# Altium project LPCB224__RLOOP__CORE_NODE.PrjPCB
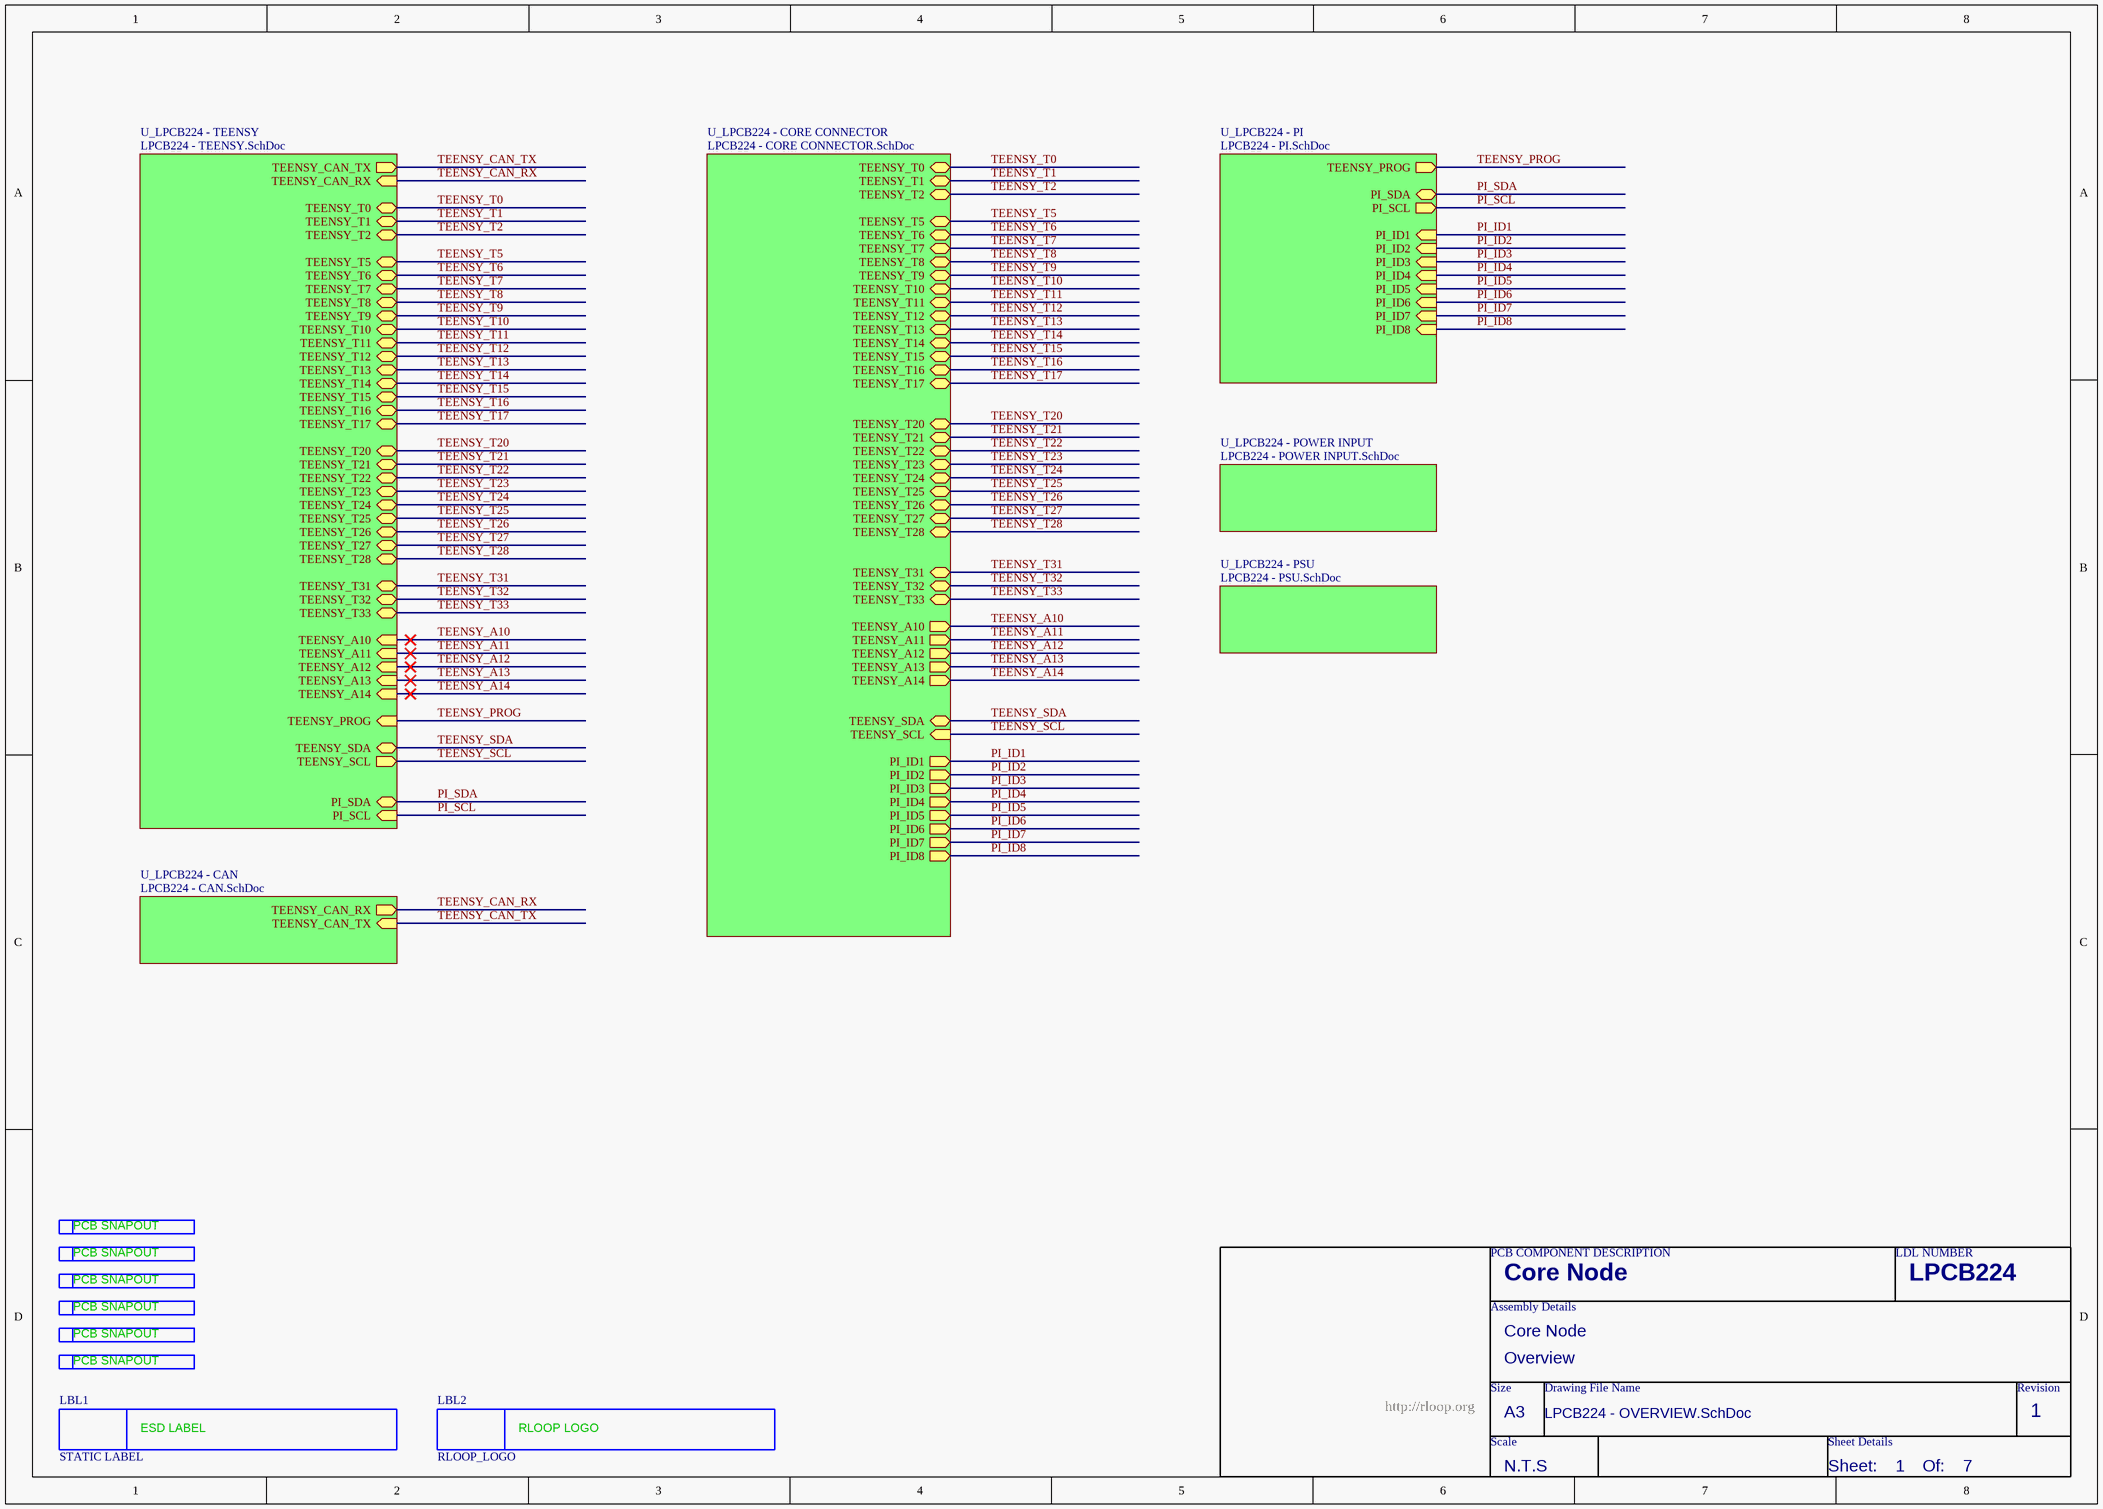
[diagram p0: LPCB224 - OVERVIEW.SchDoc]
7 sheets, 83 parts. Net scope: hierarchical (ports join the sheet entries above them; power ports are global).
Board files: LPCB224R0.PcbDoc, LPCB224R0__ASCII.PcbDoc
Sheets:
  LPCB224 - OVERVIEW.SchDoc
    U_LPCB224 - TEENSY = LPCB224 - TEENSY.SchDoc
    U_LPCB224 - CAN = LPCB224 - CAN.SchDoc
    U_LPCB224 - PSU = LPCB224 - PSU.SchDoc
    U_LPCB224 - PI = LPCB224 - PI.SchDoc
    U_LPCB224 - CORE CONNECTOR = LPCB224 - CORE CONNECTOR.SchDoc
    U_LPCB224 - POWER INPUT = LPCB224 - POWER INPUT.SchDoc

## Sheet LPCB224 - OVERVIEW.SchDoc
size A3; Address1: Factory 10; Address2: 9-13 Dingley Avenue, Dandeong, VICTORIA 3175, AUSTRALIA; DocumentNumber: 1; Revision: 1; SheetNumber: 1; SheetTotal: 7; Lockie__PCB_SUB_ASSEMBLY: Overview; Lockie__PCB_ASSEMBLY: Core Node; Lockie__LDL: LPCB224; Lockie__PCB_DESCRIPTION: Core Node

### Parts
LBL1  STATIC LABEL  [STATIC_LABEL]  (no BOM)
LBL2  RLOOP_LOGO  [RLOOP_LOGO]  (no BOM)
SN1  PCB_SNAPOUT  [SNAPOUT_NEW]  (value not drawn)  (no BOM)
SN2  PCB_SNAPOUT  [SNAPOUT_NEW]  (value not drawn)  (no BOM)
SN3  PCB_SNAPOUT  [SNAPOUT_NEW]  (value not drawn)  (no BOM)
SN4  PCB_SNAPOUT  [SNAPOUT_NEW]  (value not drawn)  (no BOM)
SN5  PCB_SNAPOUT  [SNAPOUT_NEW]  (value not drawn)  (no BOM)
SN6  PCB_SNAPOUT  [SNAPOUT_NEW]  (value not drawn)  (no BOM)

### Sub-sheets
U_LPCB224 - CAN = LPCB224 - CAN.SchDoc: TEENSY_CAN_TX (in), TEENSY_CAN_RX (out)
U_LPCB224 - CORE CONNECTOR = LPCB224 - CORE CONNECTOR.SchDoc: TEENSY_T0 (bidir), TEENSY_T1 (bidir), TEENSY_T2 (bidir), TEENSY_T5 (bidir), TEENSY_T6 (bidir), TEENSY_T7 (bidir), TEENSY_T8 (bidir), TEENSY_T9 (bidir), TEENSY_T10 (bidir), TEENSY_T11 (bidir), TEENSY_T12 (bidir), TEENSY_T13 (bidir), TEENSY_T14 (bidir), TEENSY_T15 (bidir), TEENSY_T16 (bidir), TEENSY_T17 (bidir), TEENSY_T20 (bidir), TEENSY_T21 (bidir), TEENSY_T22 (bidir), TEENSY_T23 (bidir), TEENSY_T24 (bidir), TEENSY_T25 (bidir), TEENSY_T26 (bidir), TEENSY_T27 (bidir), TEENSY_T28 (bidir), TEENSY_T31 (bidir), TEENSY_T32 (bidir), TEENSY_T33 (bidir), TEENSY_A10 (out), TEENSY_A11 (out), TEENSY_A12 (out), TEENSY_A13 (out), TEENSY_A14 (out), TEENSY_SCL (in), TEENSY_SDA (bidir), PI_ID1 (out), PI_ID2 (out), PI_ID3 (out), PI_ID4 (out), PI_ID5 (out), PI_ID6 (out), PI_ID7 (out), PI_ID8 (out)
U_LPCB224 - PI = LPCB224 - PI.SchDoc: PI_ID1 (in), PI_ID2 (in), PI_ID3 (in), PI_ID4 (in), PI_ID5 (in), PI_ID6 (in), PI_ID7 (in), PI_ID8 (in), PI_SDA (bidir), PI_SCL (out), TEENSY_PROG (out)
U_LPCB224 - POWER INPUT = LPCB224 - POWER INPUT.SchDoc: no entries
U_LPCB224 - PSU = LPCB224 - PSU.SchDoc: no entries
U_LPCB224 - TEENSY = LPCB224 - TEENSY.SchDoc: TEENSY_T0 (bidir), TEENSY_T1 (bidir), TEENSY_T2 (bidir), TEENSY_CAN_TX (out), TEENSY_CAN_RX (in), TEENSY_T5 (bidir), TEENSY_T6 (bidir), TEENSY_T7 (bidir), TEENSY_T8 (bidir), TEENSY_T9 (bidir), TEENSY_T10 (bidir), TEENSY_T11 (bidir), TEENSY_T12 (bidir), TEENSY_T13 (bidir), TEENSY_T14 (bidir), TEENSY_T15 (bidir), TEENSY_T16 (bidir), TEENSY_T17 (bidir), TEENSY_T20 (bidir), TEENSY_T21 (bidir), TEENSY_T22 (bidir), TEENSY_T23 (bidir), TEENSY_T24 (bidir), TEENSY_T25 (bidir), TEENSY_T26 (bidir), TEENSY_T27 (bidir), TEENSY_T28 (bidir), TEENSY_T31 (bidir), TEENSY_T32 (bidir), TEENSY_T33 (bidir), TEENSY_A10 (in), TEENSY_A11 (in), TEENSY_A12 (in), TEENSY_A13 (in), TEENSY_A14 (in), TEENSY_PROG (in), TEENSY_SCL (out), TEENSY_SDA (bidir), PI_SCL (in), PI_SDA (bidir)

### Nets
PI_ID1: sheet U_LPCB224 - PI/PI_ID1, sheet U_LPCB224 - CORE CONNECTOR/PI_ID1
PI_ID2: sheet U_LPCB224 - PI/PI_ID2, sheet U_LPCB224 - CORE CONNECTOR/PI_ID2
PI_ID3: sheet U_LPCB224 - PI/PI_ID3, sheet U_LPCB224 - CORE CONNECTOR/PI_ID3
PI_ID4: sheet U_LPCB224 - PI/PI_ID4, sheet U_LPCB224 - CORE CONNECTOR/PI_ID4
PI_ID5: sheet U_LPCB224 - PI/PI_ID5, sheet U_LPCB224 - CORE CONNECTOR/PI_ID5
PI_ID6: sheet U_LPCB224 - PI/PI_ID6, sheet U_LPCB224 - CORE CONNECTOR/PI_ID6
PI_ID7: sheet U_LPCB224 - PI/PI_ID7, sheet U_LPCB224 - CORE CONNECTOR/PI_ID7
PI_ID8: sheet U_LPCB224 - PI/PI_ID8, sheet U_LPCB224 - CORE CONNECTOR/PI_ID8
PI_SCL: sheet U_LPCB224 - TEENSY/PI_SCL, sheet U_LPCB224 - PI/PI_SCL
PI_SDA: sheet U_LPCB224 - TEENSY/PI_SDA, sheet U_LPCB224 - PI/PI_SDA
TEENSY_A10: sheet U_LPCB224 - TEENSY/TEENSY_A10, sheet U_LPCB224 - CORE CONNECTOR/TEENSY_A10
TEENSY_A11: sheet U_LPCB224 - TEENSY/TEENSY_A11, sheet U_LPCB224 - CORE CONNECTOR/TEENSY_A11
TEENSY_A12: sheet U_LPCB224 - TEENSY/TEENSY_A12, sheet U_LPCB224 - CORE CONNECTOR/TEENSY_A12
TEENSY_A13: sheet U_LPCB224 - TEENSY/TEENSY_A13, sheet U_LPCB224 - CORE CONNECTOR/TEENSY_A13
TEENSY_A14: sheet U_LPCB224 - TEENSY/TEENSY_A14, sheet U_LPCB224 - CORE CONNECTOR/TEENSY_A14
TEENSY_CAN_RX: sheet U_LPCB224 - TEENSY/TEENSY_CAN_RX, sheet U_LPCB224 - CAN/TEENSY_CAN_RX
TEENSY_CAN_TX: sheet U_LPCB224 - TEENSY/TEENSY_CAN_TX, sheet U_LPCB224 - CAN/TEENSY_CAN_TX
TEENSY_PROG: sheet U_LPCB224 - TEENSY/TEENSY_PROG, sheet U_LPCB224 - PI/TEENSY_PROG
TEENSY_SCL: sheet U_LPCB224 - TEENSY/TEENSY_SCL, sheet U_LPCB224 - CORE CONNECTOR/TEENSY_SCL
TEENSY_SDA: sheet U_LPCB224 - TEENSY/TEENSY_SDA, sheet U_LPCB224 - CORE CONNECTOR/TEENSY_SDA
TEENSY_T0: sheet U_LPCB224 - TEENSY/TEENSY_T0, sheet U_LPCB224 - CORE CONNECTOR/TEENSY_T0
TEENSY_T1: sheet U_LPCB224 - TEENSY/TEENSY_T1, sheet U_LPCB224 - CORE CONNECTOR/TEENSY_T1
TEENSY_T2: sheet U_LPCB224 - TEENSY/TEENSY_T2, sheet U_LPCB224 - CORE CONNECTOR/TEENSY_T2
TEENSY_T5: sheet U_LPCB224 - TEENSY/TEENSY_T5, sheet U_LPCB224 - CORE CONNECTOR/TEENSY_T5
TEENSY_T6: sheet U_LPCB224 - TEENSY/TEENSY_T6, sheet U_LPCB224 - CORE CONNECTOR/TEENSY_T6
TEENSY_T7: sheet U_LPCB224 - TEENSY/TEENSY_T7, sheet U_LPCB224 - CORE CONNECTOR/TEENSY_T7
TEENSY_T8: sheet U_LPCB224 - TEENSY/TEENSY_T8, sheet U_LPCB224 - CORE CONNECTOR/TEENSY_T8
TEENSY_T9: sheet U_LPCB224 - TEENSY/TEENSY_T9, sheet U_LPCB224 - CORE CONNECTOR/TEENSY_T9
TEENSY_T10: sheet U_LPCB224 - TEENSY/TEENSY_T10, sheet U_LPCB224 - CORE CONNECTOR/TEENSY_T10
TEENSY_T11: sheet U_LPCB224 - TEENSY/TEENSY_T11, sheet U_LPCB224 - CORE CONNECTOR/TEENSY_T11
TEENSY_T12: sheet U_LPCB224 - TEENSY/TEENSY_T12, sheet U_LPCB224 - CORE CONNECTOR/TEENSY_T12
TEENSY_T13: sheet U_LPCB224 - TEENSY/TEENSY_T13, sheet U_LPCB224 - CORE CONNECTOR/TEENSY_T13
TEENSY_T14: sheet U_LPCB224 - TEENSY/TEENSY_T14, sheet U_LPCB224 - CORE CONNECTOR/TEENSY_T14
TEENSY_T15: sheet U_LPCB224 - TEENSY/TEENSY_T15, sheet U_LPCB224 - CORE CONNECTOR/TEENSY_T15
TEENSY_T16: sheet U_LPCB224 - TEENSY/TEENSY_T16, sheet U_LPCB224 - CORE CONNECTOR/TEENSY_T16
TEENSY_T17: sheet U_LPCB224 - TEENSY/TEENSY_T17, sheet U_LPCB224 - CORE CONNECTOR/TEENSY_T17
TEENSY_T20: sheet U_LPCB224 - TEENSY/TEENSY_T20, sheet U_LPCB224 - CORE CONNECTOR/TEENSY_T20
TEENSY_T21: sheet U_LPCB224 - TEENSY/TEENSY_T21, sheet U_LPCB224 - CORE CONNECTOR/TEENSY_T21
TEENSY_T22: sheet U_LPCB224 - TEENSY/TEENSY_T22, sheet U_LPCB224 - CORE CONNECTOR/TEENSY_T22
TEENSY_T23: sheet U_LPCB224 - TEENSY/TEENSY_T23, sheet U_LPCB224 - CORE CONNECTOR/TEENSY_T23
TEENSY_T24: sheet U_LPCB224 - TEENSY/TEENSY_T24, sheet U_LPCB224 - CORE CONNECTOR/TEENSY_T24
TEENSY_T25: sheet U_LPCB224 - TEENSY/TEENSY_T25, sheet U_LPCB224 - CORE CONNECTOR/TEENSY_T25
TEENSY_T26: sheet U_LPCB224 - TEENSY/TEENSY_T26, sheet U_LPCB224 - CORE CONNECTOR/TEENSY_T26
TEENSY_T27: sheet U_LPCB224 - TEENSY/TEENSY_T27, sheet U_LPCB224 - CORE CONNECTOR/TEENSY_T27
TEENSY_T28: sheet U_LPCB224 - TEENSY/TEENSY_T28, sheet U_LPCB224 - CORE CONNECTOR/TEENSY_T28
TEENSY_T31: sheet U_LPCB224 - TEENSY/TEENSY_T31, sheet U_LPCB224 - CORE CONNECTOR/TEENSY_T31
TEENSY_T32: sheet U_LPCB224 - TEENSY/TEENSY_T32, sheet U_LPCB224 - CORE CONNECTOR/TEENSY_T32
TEENSY_T33: sheet U_LPCB224 - TEENSY/TEENSY_T33, sheet U_LPCB224 - CORE CONNECTOR/TEENSY_T33

### Notes on the sheet
- PCB COMPONENT DESCRIPTION
- LDL NUMBER
- Assembly Details
- Size
- Drawing File Name
- Revision
- http://rloop.org
- Scale
- A3
- Sheet Details
- N.T.S
- Sheet:
- Of:
- (in symbol PCB_SNAPOUT) PCB SNAPOUT
- (in symbol RLOOP_LOGO) RLOOP LOGO
- (in symbol STATIC LABEL) ESD LABEL

### Library data of the parts
LBL1 = STATIC LABEL: FMEDA__CHANNEL: DIAG; FMEDA__FUNCTION_IN_SYSTEM: *
LBL2 = RLOOP_LOGO: FMEDA__CHANNEL: DIAG; FMEDA__FUNCTION_IN_SYSTEM: *
SN1-SN6 = PCB_SNAPOUT: FMEDA__CHANNEL: DIAG; FMEDA__FUNCTION_IN_SYSTEM: *

## Sheet LPCB224 - TEENSY.SchDoc
size A3; Address1: Factory 10; Address2: 9-13 Dingley Avenue, Dandeong, VICTORIA 3175, AUSTRALIA; DocumentNumber: 7; Revision: 1; SheetNumber: 7; SheetTotal: 7; Lockie__PCB_SUB_ASSEMBLY: Teensy Interface; Lockie__PCB_ASSEMBLY: Core Node; Lockie__LDL: LPCB224; Lockie__PCB_DESCRIPTION: Core Node
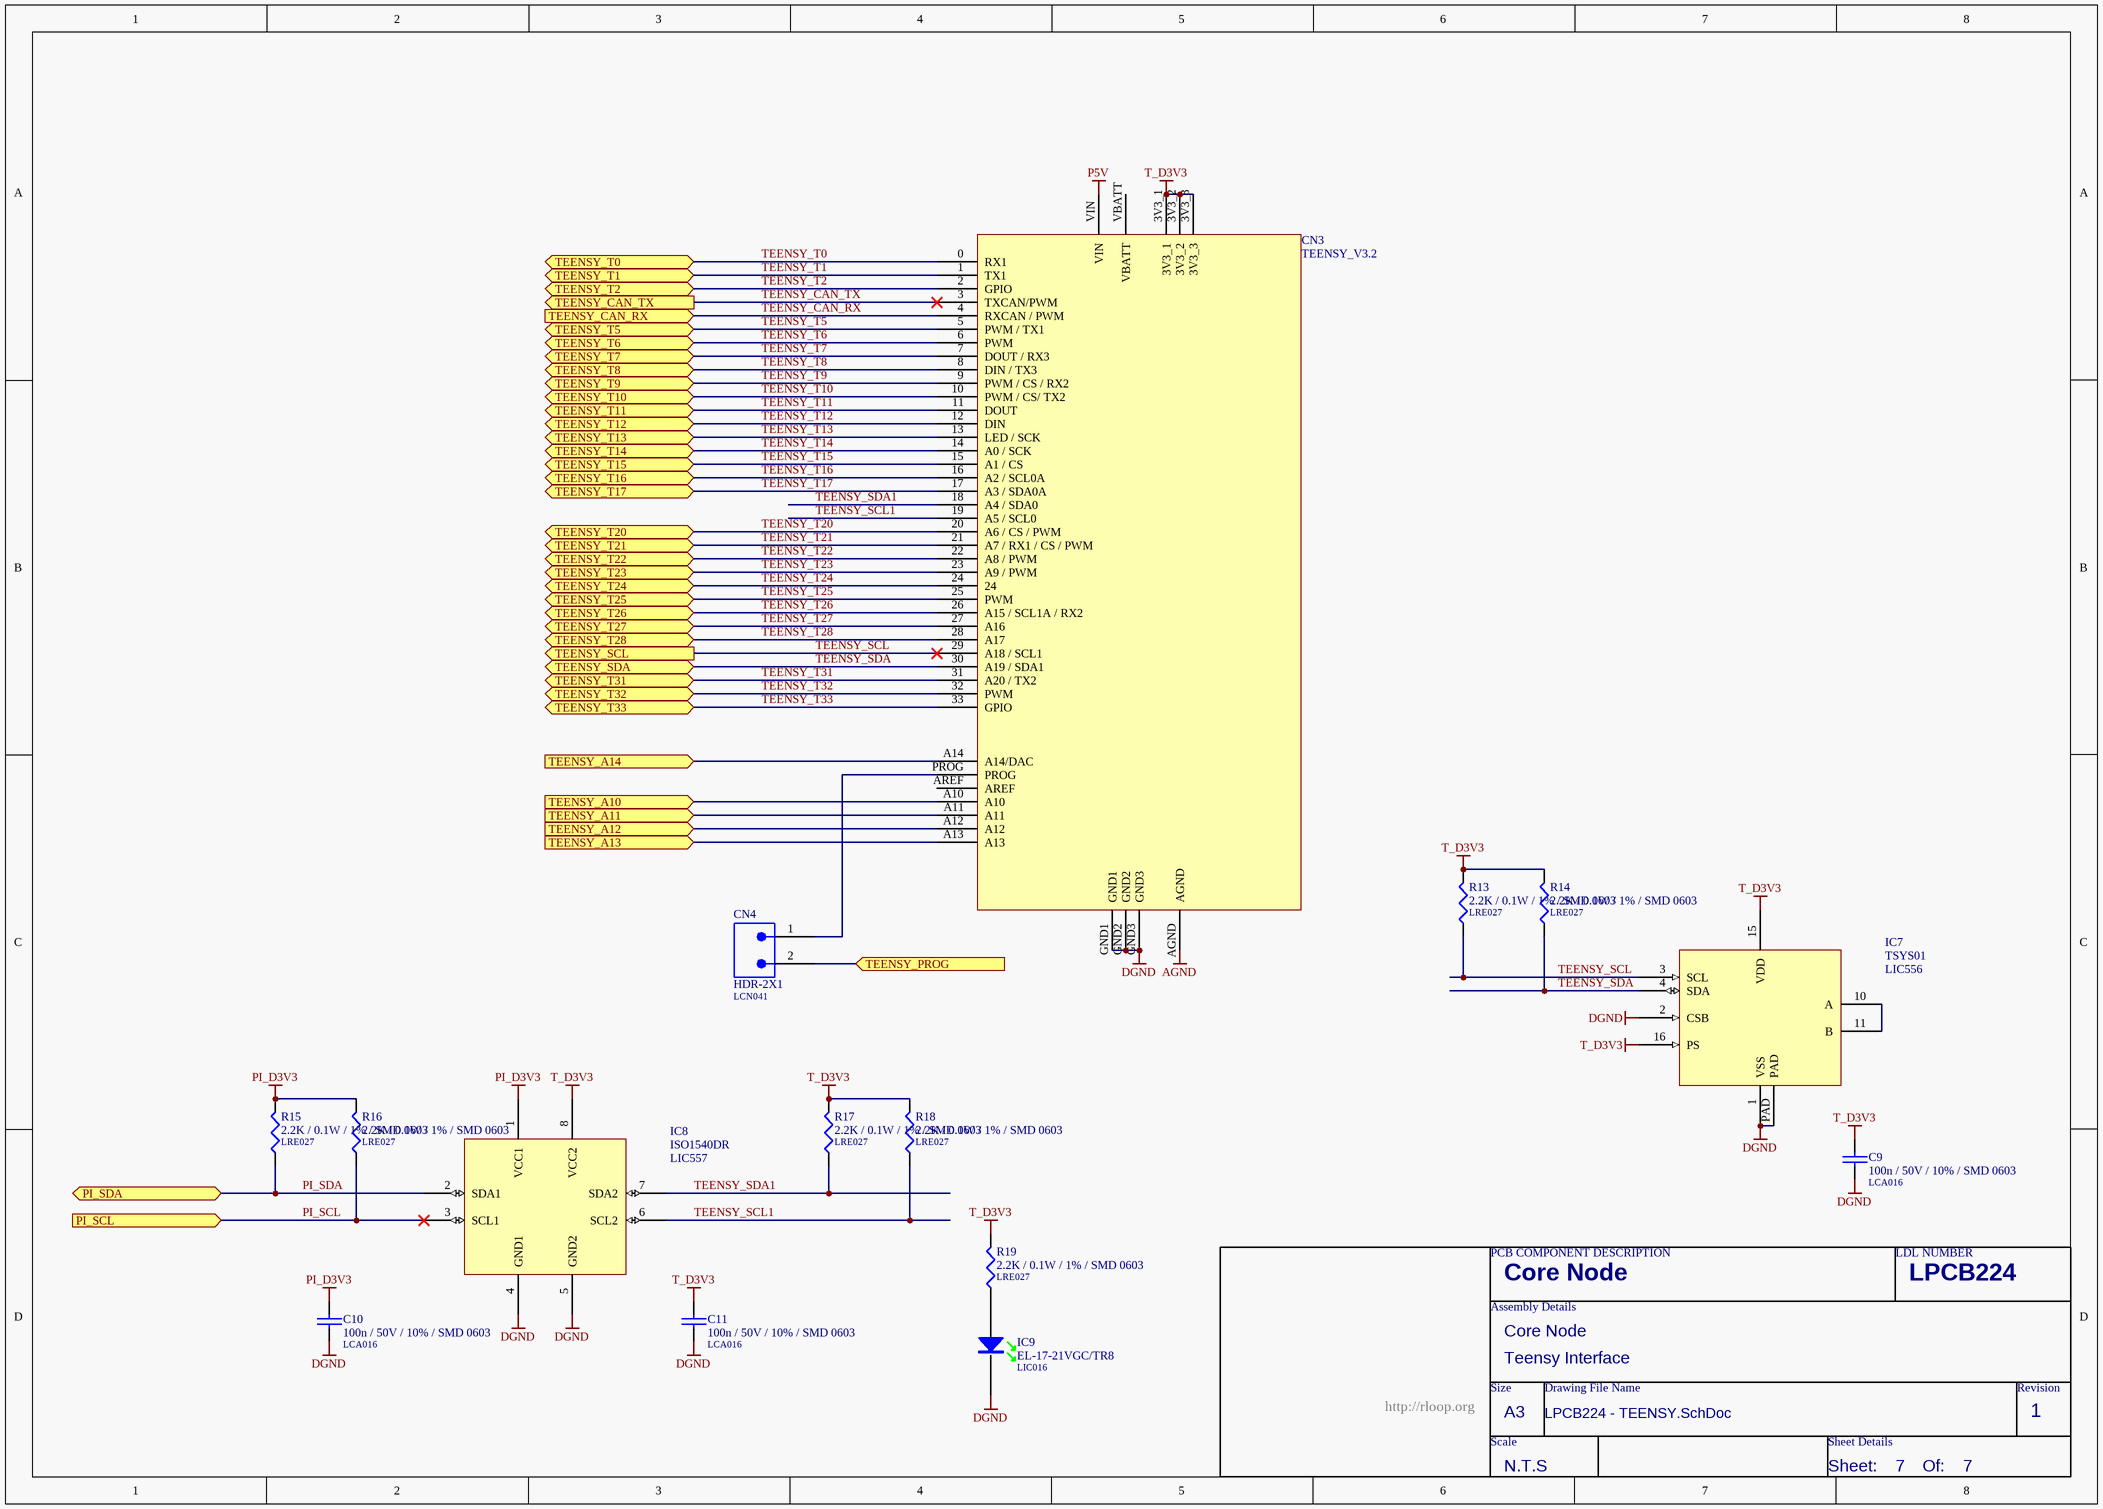
[diagram p1: LPCB224 - TEENSY.SchDoc]

### Parts
C9  100n / 50V / 10% / SMD 0603  LDL_NUMBER: LCA016  [LFP011__CC1608-0603-IPC7351_B]
C10  100n / 50V / 10% / SMD 0603  LDL_NUMBER: LCA016  [LFP011__CC1608-0603-IPC7351_B]
C11  100n / 50V / 10% / SMD 0603  LDL_NUMBER: LCA016  [LFP011__CC1608-0603-IPC7351_B]
CN3  TEENSY_V3.2  [TEENSY_V3.2]  (no BOM)
CN4  HDR-2X1  LDL_NUMBER: LCN041  [HDR-2X1]
IC7  TSYS01  LDL_NUMBER: LIC556  [LFP135__QFN65P400X400X80_HS-17M]
IC8  ISO1540DR  LDL_NUMBER: LIC557  [LFP097__SOIC150-8]
IC9  EL-17-21VGC/TR8  LDL_NUMBER: LIC016  [CR2012-0805-LED]
R13  2.2K / 0.1W / 1% / SMD 0603  LDL_NUMBER: LRE027  [LFP020__CR1608-0603-IPC7351_B]
R14  2.2K / 0.1W / 1% / SMD 0603  LDL_NUMBER: LRE027  [LFP020__CR1608-0603-IPC7351_B]
R15  2.2K / 0.1W / 1% / SMD 0603  LDL_NUMBER: LRE027  [LFP020__CR1608-0603-IPC7351_B]
R16  2.2K / 0.1W / 1% / SMD 0603  LDL_NUMBER: LRE027  [LFP020__CR1608-0603-IPC7351_B]
R17  2.2K / 0.1W / 1% / SMD 0603  LDL_NUMBER: LRE027  [LFP020__CR1608-0603-IPC7351_B]
R18  2.2K / 0.1W / 1% / SMD 0603  LDL_NUMBER: LRE027  [LFP020__CR1608-0603-IPC7351_B]
R19  2.2K / 0.1W / 1% / SMD 0603  LDL_NUMBER: LRE027  [LFP020__CR1608-0603-IPC7351_B]

### Ports
PI_SCL (in), PI_SDA (bidir), TEENSY_A10 (in), TEENSY_A11 (in), TEENSY_A12 (in), TEENSY_A13 (in), TEENSY_A14 (in), TEENSY_CAN_RX (in), TEENSY_CAN_TX (out), TEENSY_PROG (in), TEENSY_SCL (out), TEENSY_SDA (bidir), TEENSY_T0 (bidir), TEENSY_T1 (bidir), TEENSY_T2 (bidir), TEENSY_T5 (bidir), TEENSY_T6 (bidir), TEENSY_T7 (bidir), TEENSY_T8 (bidir), TEENSY_T9 (bidir), TEENSY_T10 (bidir), TEENSY_T11 (bidir), TEENSY_T12 (bidir), TEENSY_T13 (bidir), TEENSY_T14 (bidir), TEENSY_T15 (bidir), TEENSY_T16 (bidir), TEENSY_T17 (bidir), TEENSY_T20 (bidir), TEENSY_T21 (bidir), TEENSY_T22 (bidir), TEENSY_T23 (bidir), TEENSY_T24 (bidir), TEENSY_T25 (bidir), TEENSY_T26 (bidir), TEENSY_T27 (bidir), TEENSY_T28 (bidir), TEENSY_T31 (bidir), TEENSY_T32 (bidir), TEENSY_T33 (bidir)

### Nets
AGND: CN3.AGND
DGND: C9.2 C10.2 C11.2 CN3.GND1 CN3.GND2 CN3.GND3 IC7.1(VSS) IC7.2(CSB) IC7.PAD IC8.4(GND1) IC8.5(GND2) IC9.K
P5V: CN3.VIN
PI_D3V3: C10.1 IC8.1(VCC1) R15.2 R16.2
T_D3V3: C9.1 C11.1 CN3.3V3_1 CN3.3V3_2 CN3.3V3_3 IC7.15(VDD) IC7.16(PS) IC8.8(VCC2) R13.2 R14.2 R17.2 R18.2 R19.2
PI_SCL: IC8.3(SCL1) R16.1 ; port PI_SCL
PI_SDA: IC8.2(SDA1) R15.1 ; port PI_SDA
TEENSY_A10: CN3.A10 ; port TEENSY_A10
TEENSY_A11: CN3.A11 ; port TEENSY_A11
TEENSY_A12: CN3.A12 ; port TEENSY_A12
TEENSY_A13: CN3.A13 ; port TEENSY_A13
TEENSY_A14: CN3.A14(A14/DAC) ; port TEENSY_A14
TEENSY_CAN_RX: CN3.4(RXCAN_/_PWM) ; port TEENSY_CAN_RX
TEENSY_CAN_TX: CN3.3(TXCAN/PWM) ; port TEENSY_CAN_TX
TEENSY_PROG: CN4.2 ; port TEENSY_PROG
TEENSY_SCL: CN3.29(A18_/_SCL1) IC7.3(SCL) R13.1 ; port TEENSY_SCL
TEENSY_SCL1: CN3.19(A5_/_SCL0) IC8.6(SCL2) R18.1
TEENSY_SDA: CN3.30(A19_/_SDA1) IC7.4(SDA) R14.1 ; port TEENSY_SDA
TEENSY_SDA1: CN3.18(A4_/_SDA0) IC8.7(SDA2) R17.1
TEENSY_T0: CN3.0(RX1) ; port TEENSY_T0
TEENSY_T1: CN3.1(TX1) ; port TEENSY_T1
TEENSY_T2: CN3.2(GPIO) ; port TEENSY_T2
TEENSY_T5: CN3.5(PWM_/_TX1) ; port TEENSY_T5
TEENSY_T6: CN3.6(PWM) ; port TEENSY_T6
TEENSY_T7: CN3.7(DOUT_/_RX3) ; port TEENSY_T7
TEENSY_T8: CN3.8(DIN_/_TX3) ; port TEENSY_T8
TEENSY_T9: CN3.9(PWM_/_CS_/_RX2) ; port TEENSY_T9
TEENSY_T10: CN3.10(PWM_/_CS/_TX2) ; port TEENSY_T10
TEENSY_T11: CN3.11(DOUT) ; port TEENSY_T11
TEENSY_T12: CN3.12(DIN) ; port TEENSY_T12
TEENSY_T13: CN3.13(LED_/_SCK) ; port TEENSY_T13
TEENSY_T14: CN3.14(A0_/_SCK) ; port TEENSY_T14
TEENSY_T15: CN3.15(A1_/_CS) ; port TEENSY_T15
TEENSY_T16: CN3.16(A2_/_SCL0A) ; port TEENSY_T16
TEENSY_T17: CN3.17(A3_/_SDA0A) ; port TEENSY_T17
TEENSY_T20: CN3.20(A6_/_CS_/_PWM) ; port TEENSY_T20
TEENSY_T21: CN3.21(A7_/_RX1_/_CS_/_PWM) ; port TEENSY_T21
TEENSY_T22: CN3.22(A8_/_PWM) ; port TEENSY_T22
TEENSY_T23: CN3.23(A9_/_PWM) ; port TEENSY_T23
TEENSY_T24: CN3.24 ; port TEENSY_T24
TEENSY_T25: CN3.25(PWM) ; port TEENSY_T25
TEENSY_T26: CN3.26(A15_/_SCL1A_/_RX2) ; port TEENSY_T26
TEENSY_T27: CN3.27(A16) ; port TEENSY_T27
TEENSY_T28: CN3.28(A17) ; port TEENSY_T28
TEENSY_T31: CN3.31(A20_/_TX2) ; port TEENSY_T31
TEENSY_T32: CN3.32(PWM) ; port TEENSY_T32
TEENSY_T33: CN3.33(GPIO) ; port TEENSY_T33
NetCN3_PROG: CN3.PROG CN4.1
NetIC7_10: IC7.10(A) IC7.11(B)
NetIC9_A: IC9.A R19.1

Not connected (* = marked no-connect by the designer): CN3 AREF VBATT

### Notes on the sheet
- PCB COMPONENT DESCRIPTION
- LDL NUMBER
- Assembly Details
- Size
- Drawing File Name
- Revision
- http://rloop.org
- Scale
- A3
- Sheet Details
- N.T.S
- Sheet:
- Of:

### Library data of the parts
C9-C11 = 100n / 50V / 10% / SMD 0603: Capacitor, Ceramic Chip, 100nF (0.1uF), 50V, 5%, SMD 0603 [LCA016]; FMEDA__OPERATING__VOLTAGE_MIN: 0; FMEDA__OPERATING__VOLTAGE_MAX: 3.3; FMEDA__OPERATING__TEMP_MIN: -20; FMEDA__OPERATING__TEMP_TYP: 27; FMEDA__OPERATING__TEMP_MAX: 50; FMEDA__CHANNEL: COM; Value: 100n; FMEDA__FUNCTION_IN_SYSTEM: *; FMEDA__OPERATING__VOLTAGE_TYP: 3.3
CN4 = HDR-2X1: Header, 2.54mm (0.1in), 2 Pins x 1 Row (40 Per Row In Strip); FMEDA__CHANNEL: COM; FMEDA__OPERATING__CURRENT_MAX: 0; FMEDA__OPERATING__TEMP_MAX: 50; FMEDA__OPERATING__TEMP_MIN: -20; FMEDA__OPERATING__TEMP_TYP: 27; FMEDA__OPERATING__VOLTAGE_MAX: 16; FMEDA__OPERATING__VOLTAGE_TYP: 12; FMEDA__OPERATING__CURRENT_MIN: 0; FMEDA__OPERATING__CURRENT_TYP: 0; FMEDA__OPERATING__VOLTAGE_MIN: 0; FMEDA__FUNCTION_IN_SYSTEM: *
IC7 = TSYS01: IC, Digital Temp Sensor, SMD QFN16 [LIC556]
IC8 = ISO1540DR: IC, Digital Isolator for I2C, SMD SOIC8
IC9 = EL-17-21VGC/TR8: LED, SMD, 0805 Green [LIC016]; FMEDA__OPERATING__TEMP_MAX: 50; FMEDA__OPERATING__TEMP_MIN: -20; FMEDA__OPERATING__TEMP_TYP: 27; FMEDA__CHANNEL: COM; FMEDA__FUNCTION_IN_SYSTEM: *
R13-R19 = 2.2K / 0.1W / 1% / SMD 0603: Resistor, Ceramic Chip, 2.2K, 0.1W, 1%, SMD 0603 [LRE027]; FMEDA__OPERATING__VOLTAGE_MIN: 0; FMEDA__OPERATING__TEMP_MIN: -20; FMEDA__OPERATING__TEMP_TYP: 27; FMEDA__OPERATING__TEMP_MAX: 50; FMEDA__CHANNEL: COM; VALUE: 2.2K; FMEDA__OPERATING__VOLTAGE_MAX: 0; FMEDA__OPERATING__POWER_MIN: 0; FMEDA__OPERATING__POWER_MAX: 0; FMEDA__FUNCTION_IN_SYSTEM: *; FMEDA__OPERATING__VOLTAGE_TYP: 0

## Sheet LPCB224 - CAN.SchDoc
size A3; Address1: Factory 10; Address2: 9-13 Dingley Avenue, Dandeong, VICTORIA 3175, AUSTRALIA; DocumentNumber: 2; Revision: 1; SheetNumber: 2; SheetTotal: 7; Lockie__PCB_SUB_ASSEMBLY: CAN Interface; Lockie__PCB_ASSEMBLY: Core Node; Lockie__LDL: LPCB224; Lockie__PCB_DESCRIPTION: Core Node
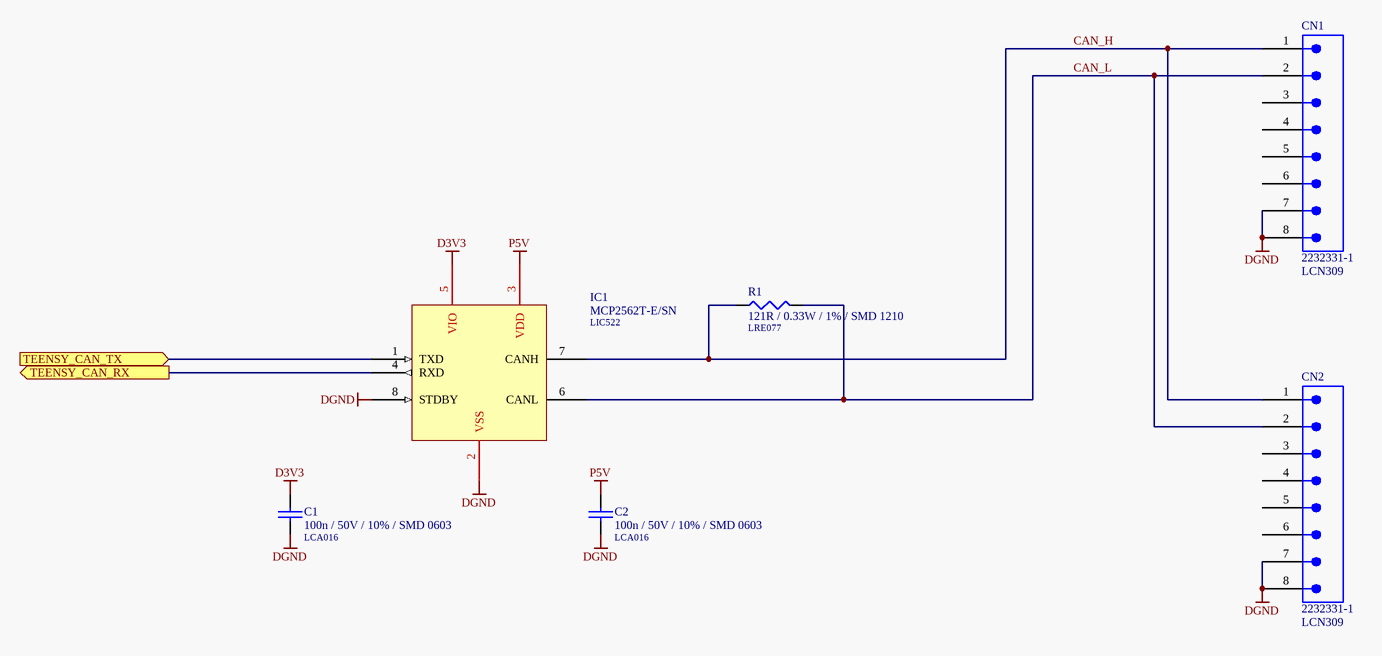
[diagram p2: LPCB224 - CAN.SchDoc]

### Parts
C1  100n / 50V / 10% / SMD 0603  LDL_NUMBER: LCA016  [LFP011__CC1608-0603-IPC7351_B]
C2  100n / 50V / 10% / SMD 0603  LDL_NUMBER: LCA016  [LFP011__CC1608-0603-IPC7351_B]
CN1  2232331-1  LDL_NUMBER: LCN309  [2232331-1]
CN2  2232331-1  LDL_NUMBER: LCN309  [2232331-1]
IC1  MCP2562T-E/SN  LDL_NUMBER: LIC522  [LFP017__SO-G8/Y1.9]
R1  121R / 0.33W / 1% / SMD 1210  LDL_NUMBER: LRE077  [LFP028__CR3225-1210]

### Ports
TEENSY_CAN_RX (out), TEENSY_CAN_TX (in)

### Nets
D3V3: C1.1 IC1.5(VIO)
DGND: C1.2 C2.2 CN1.7 CN1.8 CN2.7 CN2.8 IC1.2(VSS) IC1.8(STDBY)
P5V: C2.1 IC1.3(VDD)
CAN_H: CN1.1 CN2.1 IC1.7(CANH) R1.1
CAN_L: CN1.2 CN2.2 IC1.6(CANL) R1.2
TEENSY_CAN_RX: IC1.4(RXD) ; port TEENSY_CAN_RX
TEENSY_CAN_TX: IC1.1(TXD) ; port TEENSY_CAN_TX

Not connected (* = marked no-connect by the designer): CN1 3 4 5 6; CN2 3 4 5 6

### Notes on the sheet
- PCB COMPONENT DESCRIPTION
- LDL NUMBER
- Assembly Details
- Size
- Drawing File Name
- Revision
- http://rloop.org
- Scale
- A3
- Sheet Details
- N.T.S
- Sheet:
- Of:

### Library data of the parts
C1 C2 = 100n / 50V / 10% / SMD 0603: as C9 on sheet LPCB224 - TEENSY; Value: 100n; FMEDA__FUNCTION_IN_SYSTEM: *; FMEDA__OPERATING__VOLTAGE_TYP: 3.3
CN1 CN2 = 2232331-1: Connector, M12 8 Way, PCB Mount; FMEDA__CHANNEL: COM; FMEDA__OPERATING__CURRENT_MAX: 0; FMEDA__OPERATING__TEMP_MAX: 50; FMEDA__OPERATING__TEMP_MIN: -20; FMEDA__OPERATING__TEMP_TYP: 27; FMEDA__OPERATING__VOLTAGE_MAX: 16; FMEDA__OPERATING__VOLTAGE_TYP: 12; FMEDA__FUNCTION_IN_SYSTEM: *; FMEDA__OPERATING__CURRENT_MIN: 0; FMEDA__OPERATING__CURRENT_TYP: 0; FMEDA__OPERATING__VOLTAGE_MIN: 0
IC1 = MCP2562T-E/SN: IC, High Speed CAN Transceiver, SMD SOIC8 [LIC522]; FMEDA__OPERATING__TEMP_MAX: 50; FMEDA__OPERATING__TEMP_MIN: -20; FMEDA__OPERATING__TEMP_TYP: 27; FMEDA__OPERATING__VOLTAGE_MAX: 0; FMEDA__CHANNEL: COM; FMEDA__OPERATING__VOLTAGE_MIN: 0; FMEDA__OPERATING__VOLTAGE_TYP: 0; FMEDA__FUNCTION_IN_SYSTEM: *
R1 = 121R / 0.33W / 1% / SMD 1210: Resistor, Ceramic Chip, 121R, 0.33W, 1%, SMD 1210 [LRE077]; VALUE: 121; FMEDA__OPERATING__POWER_MAX: 0; FMEDA__OPERATING__TEMP_MAX: 50; FMEDA__OPERATING__TEMP_MIN: -20; FMEDA__OPERATING__TEMP_TYP: 27; FMEDA__CHANNEL: COM; FMEDA__OPERATING__POWER_MIN: 0; FMEDA__OPERATING__VOLTAGE_MAX: 0; FMEDA__OPERATING__VOLTAGE_MIN: 0; FMEDA__OPERATING__VOLTAGE_TYP: 0; FMEDA__FUNCTION_IN_SYSTEM: *

## Sheet LPCB224 - PSU.SchDoc
size A3; Address1: Factory 10; Address2: 9-13 Dingley Avenue, Dandeong, VICTORIA 3175, AUSTRALIA; DocumentNumber: 6; Revision: 1; SheetNumber: 6; SheetTotal: 7; Lockie__PCB_SUB_ASSEMBLY: Local Power Supplies; Lockie__PCB_ASSEMBLY: Core Node; Lockie__LDL: LPCB224; Lockie__PCB_DESCRIPTION: Core Node
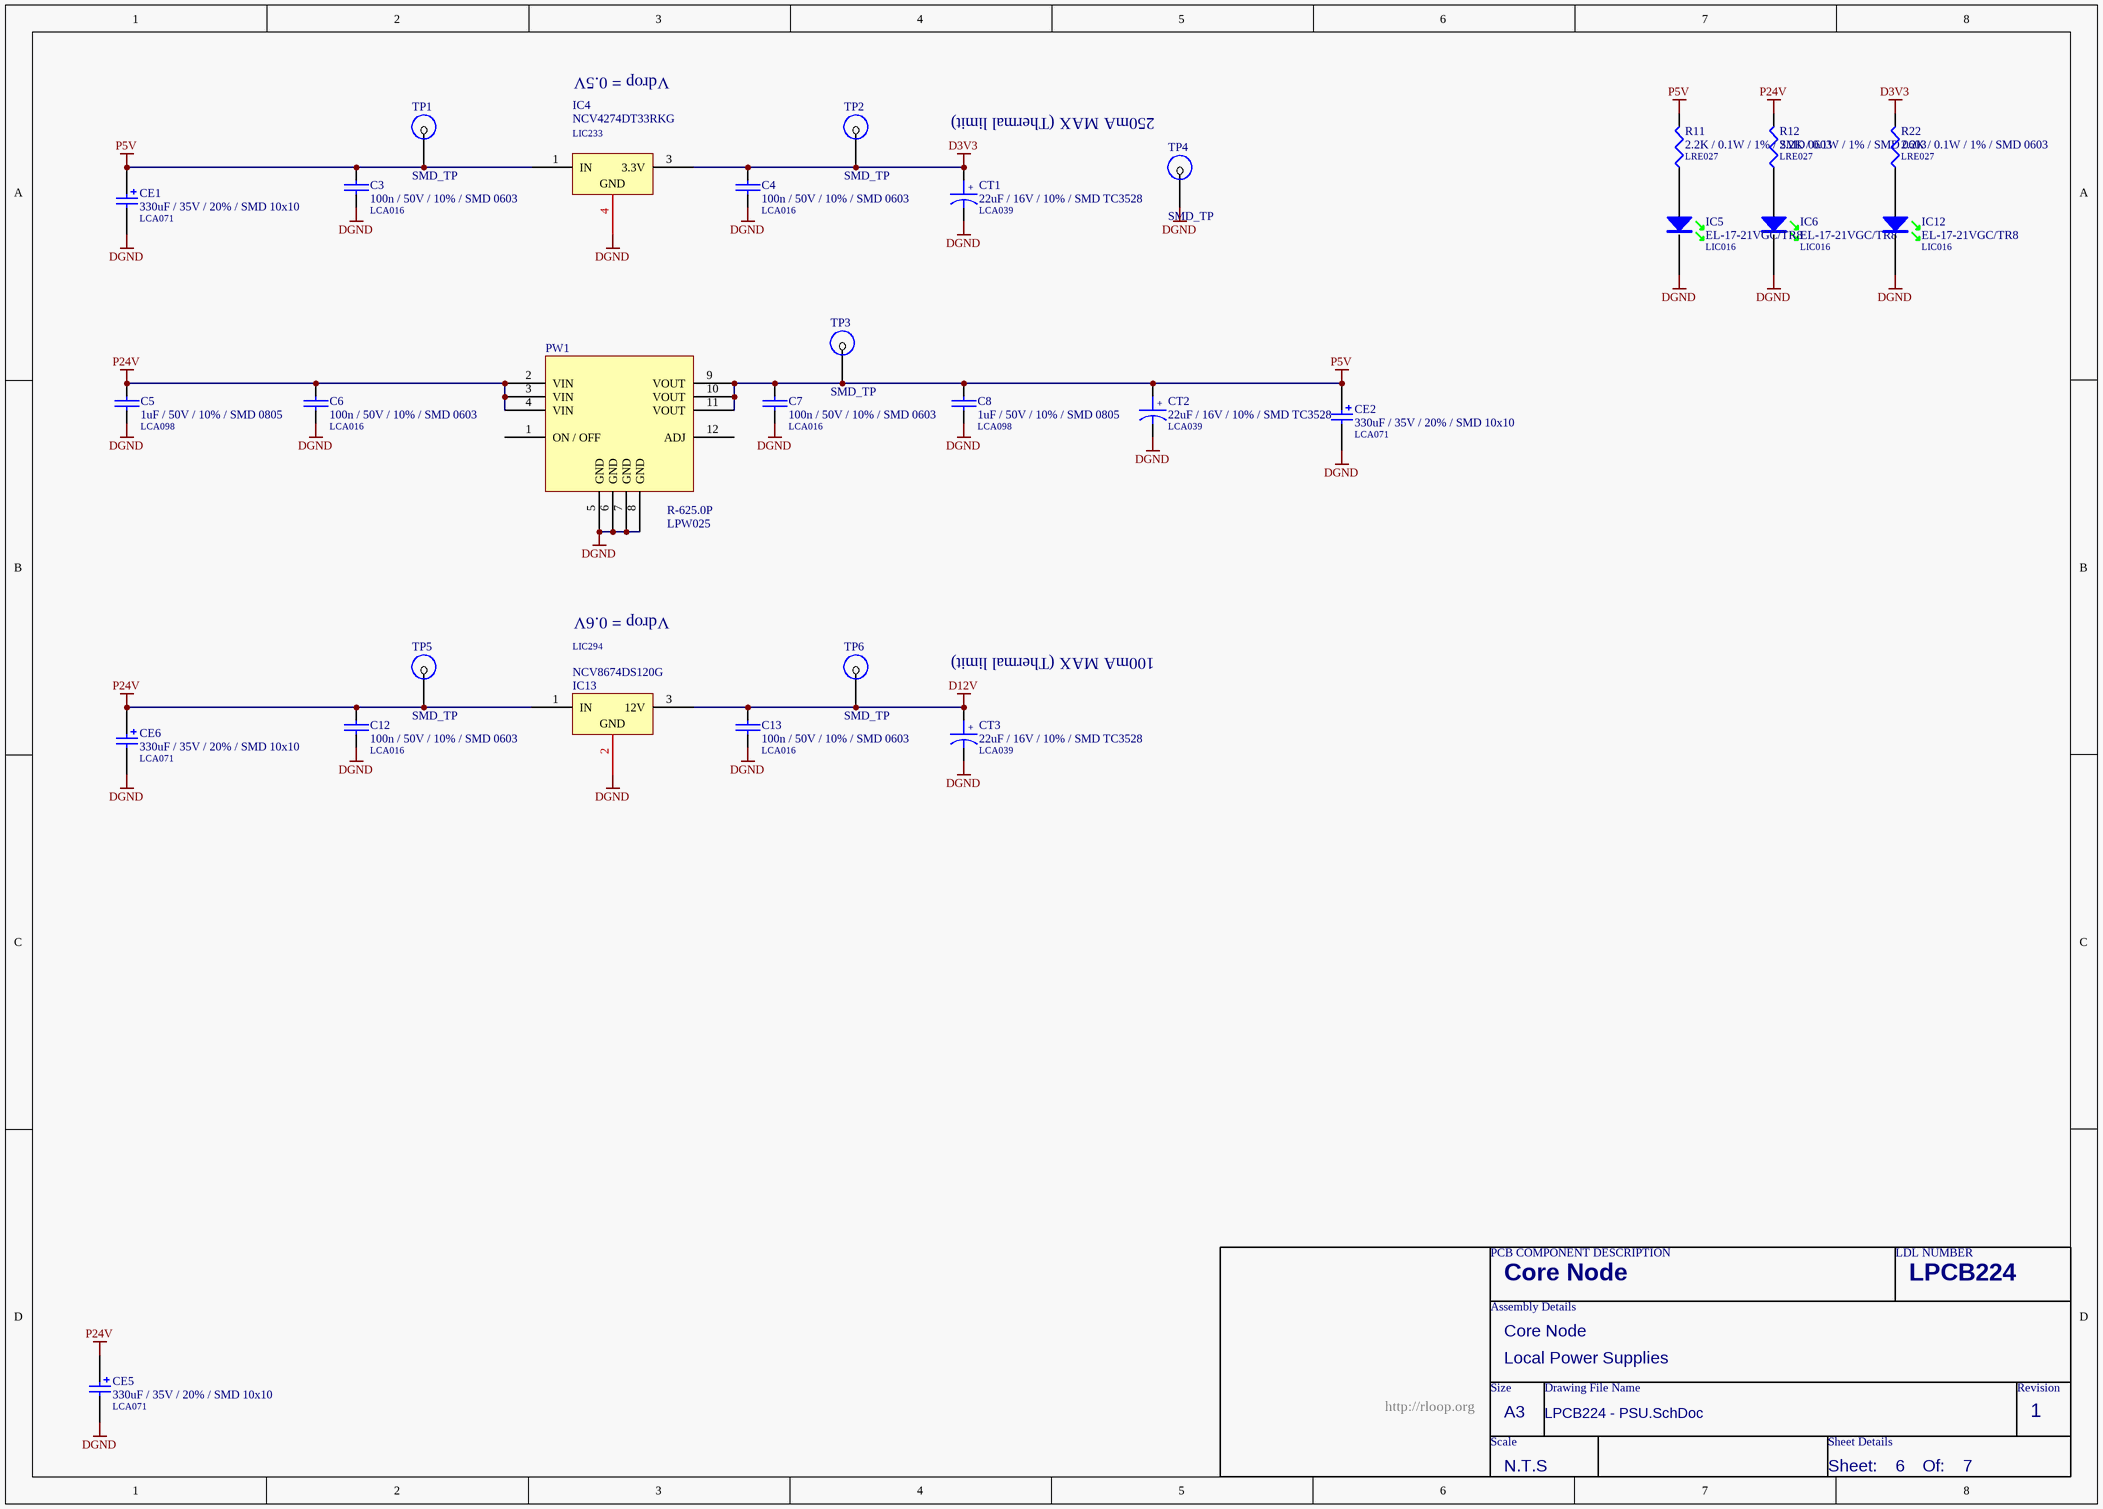
[diagram p3: LPCB224 - PSU.SchDoc]

### Parts
C3  100n / 50V / 10% / SMD 0603  LDL_NUMBER: LCA016  [LFP011__CC1608-0603-IPC7351_B]
C4  100n / 50V / 10% / SMD 0603  LDL_NUMBER: LCA016  [LFP011__CC1608-0603-IPC7351_B]
C5  1uF / 50V / 10% / SMD 0805  LDL_NUMBER: LCA098  [LFP010__CC2012-0805-IPC7351_B]
C6  100n / 50V / 10% / SMD 0603  LDL_NUMBER: LCA016  [LFP011__CC1608-0603-IPC7351_B]
C7  100n / 50V / 10% / SMD 0603  LDL_NUMBER: LCA016  [LFP011__CC1608-0603-IPC7351_B]
C8  1uF / 50V / 10% / SMD 0805  LDL_NUMBER: LCA098  [LFP010__CC2012-0805-IPC7351_B]
C12  100n / 50V / 10% / SMD 0603  LDL_NUMBER: LCA016  [LFP011__CC1608-0603-IPC7351_B]
C13  100n / 50V / 10% / SMD 0603  LDL_NUMBER: LCA016  [LFP011__CC1608-0603-IPC7351_B]
CE1  330uF / 35V / 20% / SMD 10x10  LDL_NUMBER: LCA071  [LFP041__NICHICON_WT_10X10]
CE2  330uF / 35V / 20% / SMD 10x10  LDL_NUMBER: LCA071  [LFP041__NICHICON_WT_10X10]
CE5  330uF / 35V / 20% / SMD 10x10  LDL_NUMBER: LCA071  [LFP041__NICHICON_WT_10X10]
CE6  330uF / 35V / 20% / SMD 10x10  LDL_NUMBER: LCA071  [LFP041__NICHICON_WT_10X10]
CT1  22uF / 16V / 10% / SMD TC3528  LDL_NUMBER: LCA039  [LFP018__TC3528]
CT2  22uF / 16V / 10% / SMD TC3528  LDL_NUMBER: LCA039  [LFP018__TC3528]
CT3  22uF / 16V / 10% / SMD TC3528  LDL_NUMBER: LCA039  [LFP018__TC3528]
IC4  NCV4274DT33RKG  LDL_NUMBER: LIC233  [LFP019__369A-13]
IC5  EL-17-21VGC/TR8  LDL_NUMBER: LIC016  [CR2012-0805-LED]
IC6  EL-17-21VGC/TR8  LDL_NUMBER: LIC016  [CR2012-0805-LED]
IC12  EL-17-21VGC/TR8  LDL_NUMBER: LIC016  [CR2012-0805-LED]
IC13  NCV8674DS120G  LDL_NUMBER: LIC294  [LFP082__D2PAK]
PW1  R-625.0P  LDL_NUMBER: LPW025  [R-625.0P]
R11  2.2K / 0.1W / 1% / SMD 0603  LDL_NUMBER: LRE027  [LFP020__CR1608-0603-IPC7351_B]
R12  2.2K / 0.1W / 1% / SMD 0603  LDL_NUMBER: LRE027  [LFP020__CR1608-0603-IPC7351_B]
R22  2.2K / 0.1W / 1% / SMD 0603  LDL_NUMBER: LRE027  [LFP020__CR1608-0603-IPC7351_B]
TP1  SMD_TP  [SMD-TP]  (no BOM)
TP2  SMD_TP  [SMD-TP]  (no BOM)
TP3  SMD_TP  [SMD-TP]  (no BOM)
TP4  SMD_TP  [SMD-TP]  (no BOM)
TP5  SMD_TP  [SMD-TP]  (no BOM)
TP6  SMD_TP  [SMD-TP]  (no BOM)

### Nets
D3V3: C4.1 CT1.1 IC4.3(3.3V) R22.2 TP2.1
D12V: C13.1 CT3.1 IC13.3(12V) TP6.1
DGND: C3.2 C4.2 C5.2 C6.2 C7.2 C8.2 C12.2 C13.2 CE1.2 CE2.2 CE5.2 CE6.2 CT1.2 CT2.2 CT3.2 IC4.4(GND) IC5.K IC6.K IC12.K IC13.2(GND) PW1.5(GND) PW1.6(GND) PW1.7(GND) PW1.8(GND) TP4.1
P5V: C3.1 C7.1 C8.1 CE1.1 CE2.1 CT2.1 IC4.1(IN) PW1.9(VOUT) PW1.10(VOUT) PW1.11(VOUT) R11.2 TP1.1 TP3.1
P24V: C5.1 C6.1 C12.1 CE5.1 CE6.1 IC13.1(IN) PW1.2(VIN) PW1.3(VIN) PW1.4(VIN) R12.2 TP5.1
NetIC5_A: IC5.A R11.1
NetIC6_A: IC6.A R12.1
NetIC12_A: IC12.A R22.1

Not connected (* = marked no-connect by the designer): PW1 1(ON_/_OFF) 12(ADJ)

### Notes on the sheet
- Vdrop = 0.5V
- 250mA MAX (Thermal limit)
- Vdrop = 0.6V
- (near CT3) 100mA MAX (Thermal limit)
- PCB COMPONENT DESCRIPTION
- LDL NUMBER
- Assembly Details
- Size
- Drawing File Name
- Revision
- http://rloop.org
- Scale
- A3
- Sheet Details
- N.T.S
- Sheet:
- Of:
- (in symbol 22uF / 16V / 10% / SMD TC3528) +

### Library data of the parts
C3 C4 C6 C7 C12 C13 = 100n / 50V / 10% / SMD 0603: as C9 on sheet LPCB224 - TEENSY; Value: 100n; FMEDA__FUNCTION_IN_SYSTEM: *; FMEDA__OPERATING__VOLTAGE_TYP: 3.3
C5 C8 = 1uF / 50V / 10% / SMD 0805: Capacitor, Ceramic Chip, 1uF, 50V, SMD 0805 [LCA098]; Value: 1u; FMEDA__OPERATING__VOLTAGE_MAX: 3.3; FMEDA__OPERATING__VOLTAGE_MIN: 0; FMEDA__OPERATING__TEMP_MAX: 50; FMEDA__OPERATING__TEMP_MIN: -20; FMEDA__OPERATING__TEMP_TYP: 27; FMEDA__CHANNEL: COM; FMEDA__OPERATING__VOLTAGE_TYP: 3.3; FMEDA__FUNCTION_IN_SYSTEM: *
CE1 CE2 CE5 CE6 = 330uF / 35V / 20% / SMD 10x10: Capacitor, Aluminum Electrolytic, 330uF, 35V, 20%, SMD (10mm x 10mm) [LCA071]; FMEDA__OPERATING__TEMP_MAX: 50; FMEDA__OPERATING__TEMP_MIN: -20; FMEDA__OPERATING__TEMP_TYP: 27; FMEDA__OPERATING__VOLTAGE_MAX: 0; Value: 330u; FMEDA__CHANNEL: COM; FMEDA__OPERATING__VOLTAGE_MIN: 0; FMEDA__OPERATING__VOLTAGE_TYP: 0; FMEDA__FUNCTION_IN_SYSTEM: *
CT1-CT3 = 22uF / 16V / 10% / SMD TC3528: Capacitor, Tantalum, 22uF, 16V, 10%, SMD TC3528 (BCASE) [LCA039]; Value: 22u; FMEDA__OPERATING__VOLTAGE_MAX: 3.3; FMEDA__OPERATING__VOLTAGE_MIN: 0; FMEDA__OPERATING__TEMP_MAX: 50; FMEDA__OPERATING__TEMP_MIN: -20; FMEDA__OPERATING__TEMP_TYP: 27; FMEDA__CHANNEL: COM; FMEDA__OPERATING__VOLTAGE_TYP: 3.3; FMEDA__FUNCTION_IN_SYSTEM: *
IC4 = NCV4274DT33RKG: IC, Voltage Regulator, 400mA, 3.3V LDO, SMD DPAK [LIC233]; FMEDA__OPERATING__OUTPUT_CURRENT_MIN: 0; FMEDA__OPERATING__TEMP_MAX: 50; FMEDA__OPERATING__TEMP_MIN: -20; FMEDA__OPERATING__TEMP_TYP: 27; VALUE: 0; Note: Obey Thermal Design Rules; FMEDA__CHANNEL: COM; FMEDA__OPERATING__OUTPUT_CURRENT_TYP: 0; FMEDA__OPERATING__VOLTAGE_MAX: 0; FMEDA__OPERATING__VOLTAGE_MIN: 0; FMEDA__OPERATING__VOLTAGE_TYP: 0; FMEDA__FUNCTION_IN_SYSTEM: *
IC5 IC6 IC12 = EL-17-21VGC/TR8: as IC9 on sheet LPCB224 - TEENSY; FMEDA__FUNCTION_IN_SYSTEM: *
IC13 = NCV8674DS120G: IC, Voltage Regulator, 0.35A, 12V, SMD D2PAK [LIC294]; FMEDA__OPERATING__OUTPUT_CURRENT_MIN: 0; FMEDA__OPERATING__TEMP_MAX: 50; FMEDA__OPERATING__TEMP_MIN: -20; FMEDA__OPERATING__TEMP_TYP: 27; VALUE: 0; Note: Obey Thermal Design Rules; FMEDA__CHANNEL: COM; FMEDA__OPERATING__OUTPUT_CURRENT_TYP: 0; FMEDA__OPERATING__VOLTAGE_MAX: 0; FMEDA__OPERATING__VOLTAGE_MIN: 0; FMEDA__OPERATING__VOLTAGE_TYP: 0; FMEDA__FUNCTION_IN_SYSTEM: *
PW1 = R-625.0P: Non Isolated DC/DC Module
R11 R12 R22 = 2.2K / 0.1W / 1% / SMD 0603: as R13 on sheet LPCB224 - TEENSY; VALUE: 2.2K; FMEDA__OPERATING__VOLTAGE_MAX: 0; FMEDA__OPERATING__POWER_MIN: 0; FMEDA__OPERATING__POWER_MAX: 0; FMEDA__FUNCTION_IN_SYSTEM: *; FMEDA__OPERATING__VOLTAGE_TYP: 0
TP1-TP6 = SMD_TP: SMD Test Point; FMEDA__CHANNEL: COM; FMEDA__OPERATING__CURRENT_MAX: 0; FMEDA__OPERATING__TEMP_MAX: 50; FMEDA__OPERATING__TEMP_MIN: -20; FMEDA__OPERATING__TEMP_TYP: 27; FMEDA__OPERATING__VOLTAGE_MAX: 16; FMEDA__OPERATING__VOLTAGE_TYP: 12; FMEDA__OPERATING__CURRENT_MIN: 0; FMEDA__OPERATING__CURRENT_TYP: 0; FMEDA__OPERATING__VOLTAGE_MIN: 0

## Sheet LPCB224 - PI.SchDoc
size A3; Address1: Factory 10; Address2: 9-13 Dingley Avenue, Dandeong, VICTORIA 3175, AUSTRALIA; DocumentNumber: 4; Revision: 1; SheetNumber: 4; SheetTotal: 7; Lockie__PCB_SUB_ASSEMBLY: PI Interface; Lockie__PCB_ASSEMBLY: Core Node; Lockie__LDL: LPCB224; Lockie__PCB_DESCRIPTION: Core Node
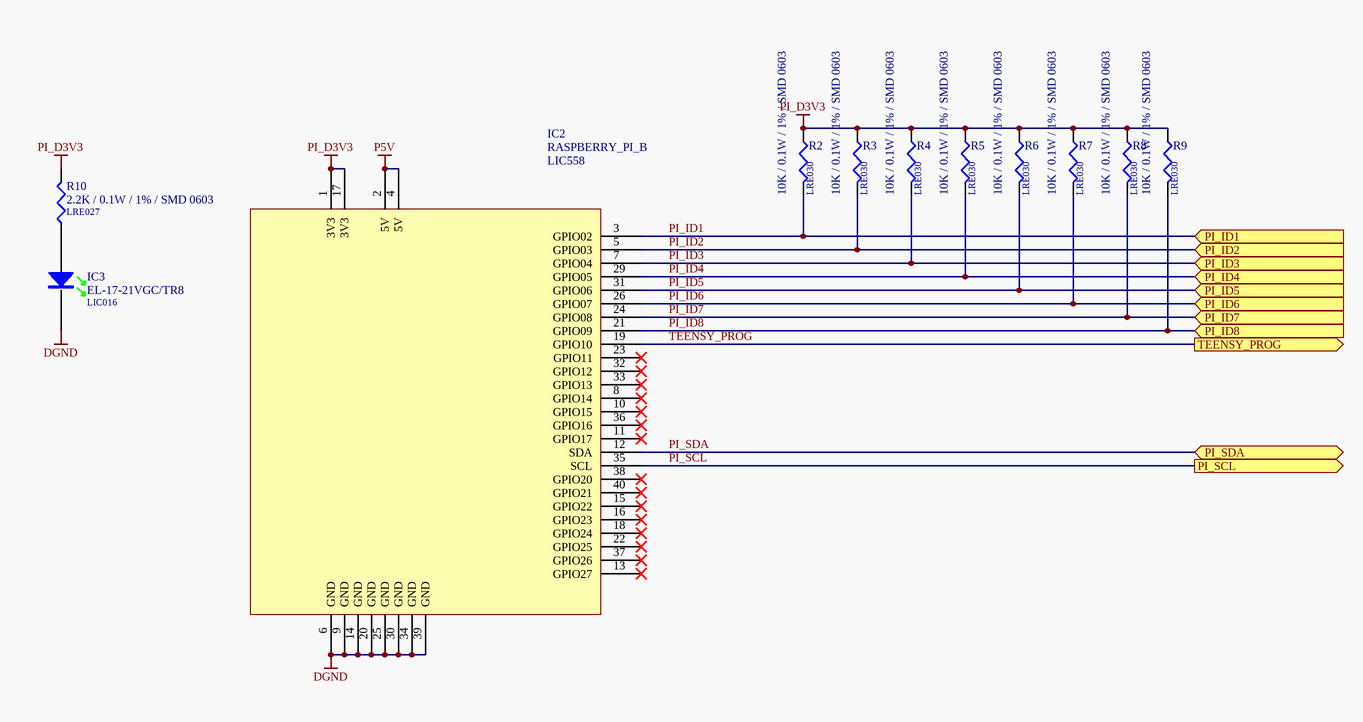
[diagram p4: LPCB224 - PI.SchDoc]

### Parts
IC2  RASPBERRY_PI_B  LDL_NUMBER: LIC558  [RASPBERRY_PI_B]
IC3  EL-17-21VGC/TR8  LDL_NUMBER: LIC016  [CR2012-0805-LED]
R2  10K / 0.1W / 1% / SMD 0603  LDL_NUMBER: LRE030  [LFP020__CR1608-0603-IPC7351_B]
R3  10K / 0.1W / 1% / SMD 0603  LDL_NUMBER: LRE030  [LFP020__CR1608-0603-IPC7351_B]
R4  10K / 0.1W / 1% / SMD 0603  LDL_NUMBER: LRE030  [LFP020__CR1608-0603-IPC7351_B]
R5  10K / 0.1W / 1% / SMD 0603  LDL_NUMBER: LRE030  [LFP020__CR1608-0603-IPC7351_B]
R6  10K / 0.1W / 1% / SMD 0603  LDL_NUMBER: LRE030  [LFP020__CR1608-0603-IPC7351_B]
R7  10K / 0.1W / 1% / SMD 0603  LDL_NUMBER: LRE030  [LFP020__CR1608-0603-IPC7351_B]
R8  10K / 0.1W / 1% / SMD 0603  LDL_NUMBER: LRE030  [LFP020__CR1608-0603-IPC7351_B]
R9  10K / 0.1W / 1% / SMD 0603  LDL_NUMBER: LRE030  [LFP020__CR1608-0603-IPC7351_B]
R10  2.2K / 0.1W / 1% / SMD 0603  LDL_NUMBER: LRE027  [LFP020__CR1608-0603-IPC7351_B]

### Ports
PI_ID1 (in), PI_ID2 (in), PI_ID3 (in), PI_ID4 (in), PI_ID5 (in), PI_ID6 (in), PI_ID7 (in), PI_ID8 (in), PI_SCL (out), PI_SDA (bidir), TEENSY_PROG (out)

### Nets
DGND: IC2.6(GND) IC2.9(GND) IC2.14(GND) IC2.20(GND) IC2.25(GND) IC2.30(GND) IC2.34(GND) IC2.39(GND) IC3.K
P5V: IC2.2(5V) IC2.4(5V)
PI_D3V3: IC2.1(3V3) IC2.17(3V3) R2.1 R3.1 R4.1 R5.1 R6.1 R7.1 R8.1 R9.1 R10.2
PI_ID1: IC2.3(GPIO02) R2.2 ; port PI_ID1
PI_ID2: IC2.5(GPIO03) R3.2 ; port PI_ID2
PI_ID3: IC2.7(GPIO04) R4.2 ; port PI_ID3
PI_ID4: IC2.29(GPIO05) R5.2 ; port PI_ID4
PI_ID5: IC2.31(GPIO06) R6.2 ; port PI_ID5
PI_ID6: IC2.26(GPIO07) R7.2 ; port PI_ID6
PI_ID7: IC2.24(GPIO08) R8.2 ; port PI_ID7
PI_ID8: IC2.21(GPIO09) R9.2 ; port PI_ID8
PI_SCL: IC2.35(SCL) ; port PI_SCL
PI_SDA: IC2.12(SDA) ; port PI_SDA
TEENSY_PROG: IC2.19(GPIO10) ; port TEENSY_PROG
NetIC3_A: IC3.A R10.1

Not connected (* = marked no-connect by the designer): IC2 8(GPIO14)* 10(GPIO15)* 11(GPIO17)* 13(GPIO27)* 15(GPIO22)* 16(GPIO23)* 18(GPIO24)* 22(GPIO25)* 23(GPIO11)* 32(GPIO12)* 33(GPIO13)* 36(GPIO16)* 37(GPIO26)* 38(GPIO20)* 40(GPIO21)*

### Notes on the sheet
- PCB COMPONENT DESCRIPTION
- LDL NUMBER
- Assembly Details
- Size
- Drawing File Name
- Revision
- http://rloop.org
- Scale
- A3
- Sheet Details
- N.T.S
- Sheet:
- Of:

### Library data of the parts
IC2 = RASPBERRY_PI_B: Raspberry Pi Model B
IC3 = EL-17-21VGC/TR8: as IC9 on sheet LPCB224 - TEENSY; FMEDA__FUNCTION_IN_SYSTEM: *
R2-R9 = 10K / 0.1W / 1% / SMD 0603: Resistor, Ceramic Chip, 10K, 0.1W, 1%, SMD 0603 [LRE030]; FMEDA__OPERATING__POWER_MAX: 0; FMEDA__OPERATING__TEMP_MAX: 50; FMEDA__OPERATING__TEMP_MIN: -20; FMEDA__OPERATING__TEMP_TYP: 27; FMEDA__CHANNEL: COM; Value: 10K; FMEDA__OPERATING__POWER_MIN: 0; FMEDA__OPERATING__VOLTAGE_MAX: 0; FMEDA__OPERATING__VOLTAGE_MIN: 0; FMEDA__OPERATING__VOLTAGE_TYP: 0; FMEDA__FUNCTION_IN_SYSTEM: *
R10 = 2.2K / 0.1W / 1% / SMD 0603: as R13 on sheet LPCB224 - TEENSY; VALUE: 2.2K; FMEDA__OPERATING__VOLTAGE_MAX: 0; FMEDA__OPERATING__POWER_MIN: 0; FMEDA__OPERATING__POWER_MAX: 0; FMEDA__FUNCTION_IN_SYSTEM: *; FMEDA__OPERATING__VOLTAGE_TYP: 0

## Sheet LPCB224 - CORE CONNECTOR.SchDoc
size A3; Address1: Factory 10; Address2: 9-13 Dingley Avenue, Dandeong, VICTORIA 3175, AUSTRALIA; DocumentNumber: 3; Revision: 1; SheetNumber: 3; SheetTotal: 7; Lockie__PCB_SUB_ASSEMBLY: Core Level Connector; Lockie__PCB_ASSEMBLY: Core Node; Lockie__LDL: LPCB224; Lockie__PCB_DESCRIPTION: Core Node
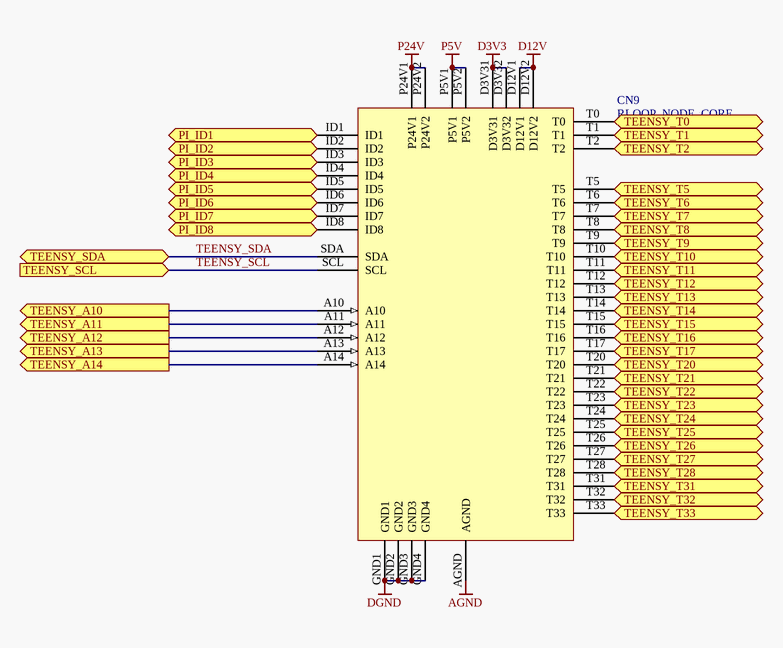
[diagram p5: LPCB224 - CORE CONNECTOR.SchDoc]

### Parts
CN9  RLOOP_NODE_CORE  [RLOOP_NODE_CORE]  (no BOM)

### Ports
PI_ID1 (out), PI_ID2 (out), PI_ID3 (out), PI_ID4 (out), PI_ID5 (out), PI_ID6 (out), PI_ID7 (out), PI_ID8 (out), TEENSY_A10 (out), TEENSY_A11 (out), TEENSY_A12 (out), TEENSY_A13 (out), TEENSY_A14 (out), TEENSY_SCL (in), TEENSY_SDA (bidir), TEENSY_T0 (bidir), TEENSY_T1 (bidir), TEENSY_T2 (bidir), TEENSY_T5 (bidir), TEENSY_T6 (bidir), TEENSY_T7 (bidir), TEENSY_T8 (bidir), TEENSY_T9 (bidir), TEENSY_T10 (bidir), TEENSY_T11 (bidir), TEENSY_T12 (bidir), TEENSY_T13 (bidir), TEENSY_T14 (bidir), TEENSY_T15 (bidir), TEENSY_T16 (bidir), TEENSY_T17 (bidir), TEENSY_T20 (bidir), TEENSY_T21 (bidir), TEENSY_T22 (bidir), TEENSY_T23 (bidir), TEENSY_T24 (bidir), TEENSY_T25 (bidir), TEENSY_T26 (bidir), TEENSY_T27 (bidir), TEENSY_T28 (bidir), TEENSY_T31 (bidir), TEENSY_T32 (bidir), TEENSY_T33 (bidir)

### Nets
AGND: CN9.AGND
D3V3: CN9.D3V31 CN9.D3V32
D12V: CN9.D12V1 CN9.D12V2
DGND: CN9.GND1 CN9.GND2 CN9.GND3 CN9.GND4
P5V: CN9.P5V1 CN9.P5V2
P24V: CN9.P24V1 CN9.P24V2
PI_ID1: CN9.ID1 ; port PI_ID1
PI_ID2: CN9.ID2 ; port PI_ID2
PI_ID3: CN9.ID3 ; port PI_ID3
PI_ID4: CN9.ID4 ; port PI_ID4
PI_ID5: CN9.ID5 ; port PI_ID5
PI_ID6: CN9.ID6 ; port PI_ID6
PI_ID7: CN9.ID7 ; port PI_ID7
PI_ID8: CN9.ID8 ; port PI_ID8
TEENSY_A10: CN9.A10 ; port TEENSY_A10
TEENSY_A11: CN9.A11 ; port TEENSY_A11
TEENSY_A12: CN9.A12 ; port TEENSY_A12
TEENSY_A13: CN9.A13 ; port TEENSY_A13
TEENSY_A14: CN9.A14 ; port TEENSY_A14
TEENSY_SCL: CN9.SCL ; port TEENSY_SCL
TEENSY_SDA: CN9.SDA ; port TEENSY_SDA
TEENSY_T0: CN9.T0 ; port TEENSY_T0
TEENSY_T1: CN9.T1 ; port TEENSY_T1
TEENSY_T2: CN9.T2 ; port TEENSY_T2
TEENSY_T5: CN9.T5 ; port TEENSY_T5
TEENSY_T6: CN9.T6 ; port TEENSY_T6
TEENSY_T7: CN9.T7 ; port TEENSY_T7
TEENSY_T8: CN9.T8 ; port TEENSY_T8
TEENSY_T9: CN9.T9 ; port TEENSY_T9
TEENSY_T10: CN9.T10 ; port TEENSY_T10
TEENSY_T11: CN9.T11 ; port TEENSY_T11
TEENSY_T12: CN9.T12 ; port TEENSY_T12
TEENSY_T13: CN9.T13 ; port TEENSY_T13
TEENSY_T14: CN9.T14 ; port TEENSY_T14
TEENSY_T15: CN9.T15 ; port TEENSY_T15
TEENSY_T16: CN9.T16 ; port TEENSY_T16
TEENSY_T17: CN9.T17 ; port TEENSY_T17
TEENSY_T20: CN9.T20 ; port TEENSY_T20
TEENSY_T21: CN9.T21 ; port TEENSY_T21
TEENSY_T22: CN9.T22 ; port TEENSY_T22
TEENSY_T23: CN9.T23 ; port TEENSY_T23
TEENSY_T24: CN9.T24 ; port TEENSY_T24
TEENSY_T25: CN9.T25 ; port TEENSY_T25
TEENSY_T26: CN9.T26 ; port TEENSY_T26
TEENSY_T27: CN9.T27 ; port TEENSY_T27
TEENSY_T28: CN9.T28 ; port TEENSY_T28
TEENSY_T31: CN9.T31 ; port TEENSY_T31
TEENSY_T32: CN9.T32 ; port TEENSY_T32
TEENSY_T33: CN9.T33 ; port TEENSY_T33

### Notes on the sheet
- PCB COMPONENT DESCRIPTION
- LDL NUMBER
- Assembly Details
- Size
- Drawing File Name
- Revision
- http://rloop.org
- Scale
- A3
- Sheet Details
- N.T.S
- Sheet:
- Of:

### Library data of the parts
CN9 = RLOOP_NODE_CORE: rLoop Node Core Connector; FMEDA__CHANNEL: COM; FMEDA__OPERATING__CURRENT_MAX: 0; FMEDA__OPERATING__TEMP_MAX: 50; FMEDA__OPERATING__TEMP_MIN: -20; FMEDA__OPERATING__TEMP_TYP: 27; FMEDA__OPERATING__VOLTAGE_MAX: 16; FMEDA__OPERATING__VOLTAGE_TYP: 12; FMEDA__OPERATING__CURRENT_MIN: 0; FMEDA__OPERATING__CURRENT_TYP: 0; FMEDA__OPERATING__VOLTAGE_MIN: 0

## Sheet LPCB224 - POWER INPUT.SchDoc
size A3; Address1: Factory 10; Address2: 9-13 Dingley Avenue, Dandeong, VICTORIA 3175, AUSTRALIA; DocumentNumber: 5; Revision: 1; SheetNumber: 5; SheetTotal: 7; Lockie__PCB_SUB_ASSEMBLY: Power Input System; Lockie__PCB_ASSEMBLY: Core Node; Lockie__LDL: LPCB224; Lockie__PCB_DESCRIPTION: Core Node
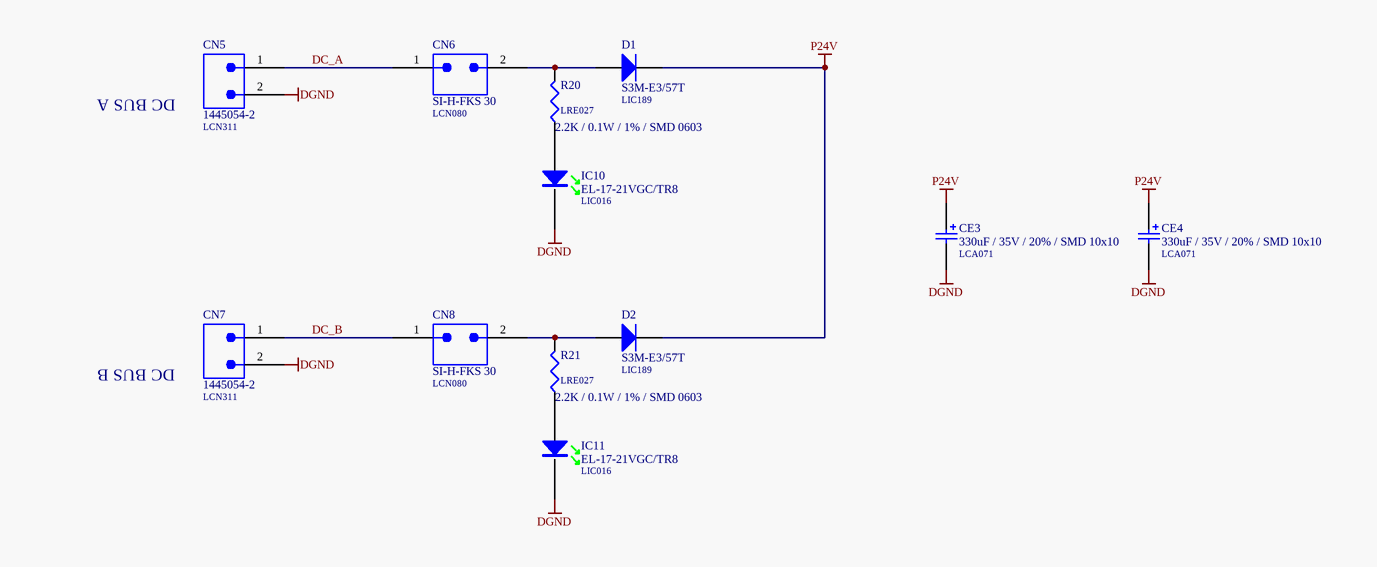
[diagram p6: LPCB224 - POWER INPUT.SchDoc]

### Parts
CE3  330uF / 35V / 20% / SMD 10x10  LDL_NUMBER: LCA071  [LFP041__NICHICON_WT_10X10]
CE4  330uF / 35V / 20% / SMD 10x10  LDL_NUMBER: LCA071  [LFP041__NICHICON_WT_10X10]
CN5  1445054-2  LDL_NUMBER: LCN311  [1445054-2]
CN6  SI-H-FKS 30  LDL_NUMBER: LCN080  [SI-H-FKS-30]
CN7  1445054-2  LDL_NUMBER: LCN311  [1445054-2]
CN8  SI-H-FKS 30  LDL_NUMBER: LCN080  [SI-H-FKS-30]
D1  S3M-E3/57T  LDL_NUMBER: LIC189  [LFP040__DO-214AB]
D2  S3M-E3/57T  LDL_NUMBER: LIC189  [LFP040__DO-214AB]
IC10  EL-17-21VGC/TR8  LDL_NUMBER: LIC016  [CR2012-0805-LED]
IC11  EL-17-21VGC/TR8  LDL_NUMBER: LIC016  [CR2012-0805-LED]
R20  2.2K / 0.1W / 1% / SMD 0603  LDL_NUMBER: LRE027  [LFP020__CR1608-0603-IPC7351_B]
R21  2.2K / 0.1W / 1% / SMD 0603  LDL_NUMBER: LRE027  [LFP020__CR1608-0603-IPC7351_B]

### Nets
DGND: CE3.2 CE4.2 CN5.2 CN7.2 IC10.K IC11.K
P24V: CE3.1 CE4.1 D1.1(K) D2.1(K)
DC_A: CN5.1 CN6.1
DC_B: CN7.1 CN8.1
NetCN6_2: CN6.2 D1.2(A) R20.2
NetCN8_2: CN8.2 D2.2(A) R21.2
NetIC10_A: IC10.A R20.1
NetIC11_A: IC11.A R21.1

### Notes on the sheet
- DC BUS A
- DC BUS B
- PCB COMPONENT DESCRIPTION
- LDL NUMBER
- Assembly Details
- Size
- Drawing File Name
- Revision
- http://rloop.org
- Scale
- A3
- Sheet Details
- N.T.S
- Sheet:
- Of:

### Library data of the parts
CE3 CE4 = 330uF / 35V / 20% / SMD 10x10: as CE1 on sheet LPCB224 - PSU; FMEDA__OPERATING__VOLTAGE_MIN: 0; FMEDA__OPERATING__VOLTAGE_TYP: 0; FMEDA__FUNCTION_IN_SYSTEM: *
CN5 CN7 = 1445054-2: Connector, MATE-N-LOK, Header, 2 Way, PTH; FMEDA__CHANNEL: COM; FMEDA__OPERATING__CURRENT_MAX: 0; FMEDA__OPERATING__TEMP_MAX: 50; FMEDA__OPERATING__TEMP_MIN: -20; FMEDA__OPERATING__TEMP_TYP: 27; FMEDA__OPERATING__VOLTAGE_MAX: 16; FMEDA__OPERATING__VOLTAGE_TYP: 12; FMEDA__OPERATING__CURRENT_MIN: 0; FMEDA__OPERATING__CURRENT_TYP: 0; FMEDA__OPERATING__VOLTAGE_MIN: 0; FMEDA__FUNCTION_IN_SYSTEM: *
CN6 CN8 = SI-H-FKS 30: Connector, Blade Fuse Holder, 5mm Terminals, 30A Max, PTH; FMEDA__CHANNEL: COM; FMEDA__OPERATING__CURRENT_MAX: 0; FMEDA__OPERATING__TEMP_MAX: 50; FMEDA__OPERATING__TEMP_MIN: -20; FMEDA__OPERATING__TEMP_TYP: 27; FMEDA__OPERATING__VOLTAGE_MAX: 16; FMEDA__OPERATING__VOLTAGE_TYP: 12; FMEDA__FUNCTION_IN_SYSTEM: *; FMEDA__OPERATING__CURRENT_MIN: 0; FMEDA__OPERATING__CURRENT_TYP: 0; FMEDA__OPERATING__VOLTAGE_MIN: 0
D1 D2 = S3M-E3/57T: Diode, General Purpose Rectifier, 3A, 200V, SMD DO-214AB [LIC189]; FMEDA__OPERATING__CURRENT_MAX: 0; FMEDA__OPERATING__TEMP_MAX: 50; FMEDA__OPERATING__TEMP_MIN: -20; FMEDA__OPERATING__TEMP_TYP: 27; FMEDA__CHANNEL: COM; FMEDA__OPERATING__CURRENT_MIN: 0; FMEDA__OPERATING__CURRENT_TYP: 0; FMEDA__OPERATING__VOLTAGE_MAX: 0; FMEDA__OPERATING__VOLTAGE_MIN: 0; FMEDA__OPERATING__VOLTAGE_TYP: 0; FMEDA__FUNCTION_IN_SYSTEM: *
IC10 IC11 = EL-17-21VGC/TR8: as IC9 on sheet LPCB224 - TEENSY; FMEDA__FUNCTION_IN_SYSTEM: *
R20 R21 = 2.2K / 0.1W / 1% / SMD 0603: as R13 on sheet LPCB224 - TEENSY; VALUE: 2.2K; FMEDA__OPERATING__VOLTAGE_MAX: 0; FMEDA__OPERATING__POWER_MIN: 0; FMEDA__OPERATING__POWER_MAX: 0; FMEDA__FUNCTION_IN_SYSTEM: *; FMEDA__OPERATING__VOLTAGE_TYP: 0

## Nets that join several sheets
AGND: LPCB224 - TEENSY (CN3.AGND), LPCB224 - CORE CONNECTOR (CN9.AGND)
D3V3: LPCB224 - CAN (C1.1 IC1.5), LPCB224 - PSU (5 pins), LPCB224 - CORE CONNECTOR (CN9.D3V31 CN9.D3V32)
D12V: LPCB224 - PSU (C13.1 CT3.1 IC13.3 TP6.1), LPCB224 - CORE CONNECTOR (CN9.D12V1 CN9.D12V2)
DGND: LPCB224 - TEENSY (12 pins), LPCB224 - CAN (8 pins), LPCB224 - PSU (25 pins), LPCB224 - PI (9 pins), LPCB224 - CORE CONNECTOR (CN9.GND1 CN9.GND2 CN9.GND3 CN9.GND4), LPCB224 - POWER INPUT (6 pins)
P5V: LPCB224 - TEENSY (CN3.VIN), LPCB224 - CAN (C2.1 IC1.3), LPCB224 - PSU (13 pins), LPCB224 - PI (IC2.2 IC2.4), LPCB224 - CORE CONNECTOR (CN9.P5V1 CN9.P5V2)
P24V: LPCB224 - PSU (11 pins), LPCB224 - CORE CONNECTOR (CN9.P24V1 CN9.P24V2), LPCB224 - POWER INPUT (CE3.1 CE4.1 D1.1 D2.1)
PI_D3V3: LPCB224 - TEENSY (C10.1 IC8.1 R15.2 R16.2), LPCB224 - PI (11 pins)
PI_ID1: LPCB224 - PI (IC2.3 R2.2), LPCB224 - CORE CONNECTOR (CN9.ID1)
PI_ID2: LPCB224 - PI (IC2.5 R3.2), LPCB224 - CORE CONNECTOR (CN9.ID2)
PI_ID3: LPCB224 - PI (IC2.7 R4.2), LPCB224 - CORE CONNECTOR (CN9.ID3)
PI_ID4: LPCB224 - PI (IC2.29 R5.2), LPCB224 - CORE CONNECTOR (CN9.ID4)
PI_ID5: LPCB224 - PI (IC2.31 R6.2), LPCB224 - CORE CONNECTOR (CN9.ID5)
PI_ID6: LPCB224 - PI (IC2.26 R7.2), LPCB224 - CORE CONNECTOR (CN9.ID6)
PI_ID7: LPCB224 - PI (IC2.24 R8.2), LPCB224 - CORE CONNECTOR (CN9.ID7)
PI_ID8: LPCB224 - PI (IC2.21 R9.2), LPCB224 - CORE CONNECTOR (CN9.ID8)
PI_SCL: LPCB224 - TEENSY (IC8.3 R16.1), LPCB224 - PI (IC2.35)
PI_SDA: LPCB224 - TEENSY (IC8.2 R15.1), LPCB224 - PI (IC2.12)
TEENSY_A10: LPCB224 - TEENSY (CN3.A10), LPCB224 - CORE CONNECTOR (CN9.A10)
TEENSY_A11: LPCB224 - TEENSY (CN3.A11), LPCB224 - CORE CONNECTOR (CN9.A11)
TEENSY_A12: LPCB224 - TEENSY (CN3.A12), LPCB224 - CORE CONNECTOR (CN9.A12)
TEENSY_A13: LPCB224 - TEENSY (CN3.A13), LPCB224 - CORE CONNECTOR (CN9.A13)
TEENSY_A14: LPCB224 - TEENSY (CN3.A14), LPCB224 - CORE CONNECTOR (CN9.A14)
TEENSY_CAN_RX: LPCB224 - TEENSY (CN3.4), LPCB224 - CAN (IC1.4)
TEENSY_CAN_TX: LPCB224 - TEENSY (CN3.3), LPCB224 - CAN (IC1.1)
TEENSY_PROG: LPCB224 - TEENSY (CN4.2), LPCB224 - PI (IC2.19)
TEENSY_SCL: LPCB224 - TEENSY (CN3.29 IC7.3 R13.1), LPCB224 - CORE CONNECTOR (CN9.SCL)
TEENSY_SDA: LPCB224 - TEENSY (CN3.30 IC7.4 R14.1), LPCB224 - CORE CONNECTOR (CN9.SDA)
TEENSY_T0: LPCB224 - TEENSY (CN3.0), LPCB224 - CORE CONNECTOR (CN9.T0)
TEENSY_T1: LPCB224 - TEENSY (CN3.1), LPCB224 - CORE CONNECTOR (CN9.T1)
TEENSY_T2: LPCB224 - TEENSY (CN3.2), LPCB224 - CORE CONNECTOR (CN9.T2)
TEENSY_T5: LPCB224 - TEENSY (CN3.5), LPCB224 - CORE CONNECTOR (CN9.T5)
TEENSY_T6: LPCB224 - TEENSY (CN3.6), LPCB224 - CORE CONNECTOR (CN9.T6)
TEENSY_T7: LPCB224 - TEENSY (CN3.7), LPCB224 - CORE CONNECTOR (CN9.T7)
TEENSY_T8: LPCB224 - TEENSY (CN3.8), LPCB224 - CORE CONNECTOR (CN9.T8)
TEENSY_T9: LPCB224 - TEENSY (CN3.9), LPCB224 - CORE CONNECTOR (CN9.T9)
TEENSY_T10: LPCB224 - TEENSY (CN3.10), LPCB224 - CORE CONNECTOR (CN9.T10)
TEENSY_T11: LPCB224 - TEENSY (CN3.11), LPCB224 - CORE CONNECTOR (CN9.T11)
TEENSY_T12: LPCB224 - TEENSY (CN3.12), LPCB224 - CORE CONNECTOR (CN9.T12)
TEENSY_T13: LPCB224 - TEENSY (CN3.13), LPCB224 - CORE CONNECTOR (CN9.T13)
TEENSY_T14: LPCB224 - TEENSY (CN3.14), LPCB224 - CORE CONNECTOR (CN9.T14)
TEENSY_T15: LPCB224 - TEENSY (CN3.15), LPCB224 - CORE CONNECTOR (CN9.T15)
TEENSY_T16: LPCB224 - TEENSY (CN3.16), LPCB224 - CORE CONNECTOR (CN9.T16)
TEENSY_T17: LPCB224 - TEENSY (CN3.17), LPCB224 - CORE CONNECTOR (CN9.T17)
TEENSY_T20: LPCB224 - TEENSY (CN3.20), LPCB224 - CORE CONNECTOR (CN9.T20)
TEENSY_T21: LPCB224 - TEENSY (CN3.21), LPCB224 - CORE CONNECTOR (CN9.T21)
TEENSY_T22: LPCB224 - TEENSY (CN3.22), LPCB224 - CORE CONNECTOR (CN9.T22)
TEENSY_T23: LPCB224 - TEENSY (CN3.23), LPCB224 - CORE CONNECTOR (CN9.T23)
TEENSY_T24: LPCB224 - TEENSY (CN3.24), LPCB224 - CORE CONNECTOR (CN9.T24)
TEENSY_T25: LPCB224 - TEENSY (CN3.25), LPCB224 - CORE CONNECTOR (CN9.T25)
TEENSY_T26: LPCB224 - TEENSY (CN3.26), LPCB224 - CORE CONNECTOR (CN9.T26)
TEENSY_T27: LPCB224 - TEENSY (CN3.27), LPCB224 - CORE CONNECTOR (CN9.T27)
TEENSY_T28: LPCB224 - TEENSY (CN3.28), LPCB224 - CORE CONNECTOR (CN9.T28)
TEENSY_T31: LPCB224 - TEENSY (CN3.31), LPCB224 - CORE CONNECTOR (CN9.T31)
TEENSY_T32: LPCB224 - TEENSY (CN3.32), LPCB224 - CORE CONNECTOR (CN9.T32)
TEENSY_T33: LPCB224 - TEENSY (CN3.33), LPCB224 - CORE CONNECTOR (CN9.T33)